# Altium project PoE_Injector_DownloadStation.PrjPcb (part 1 of 2)
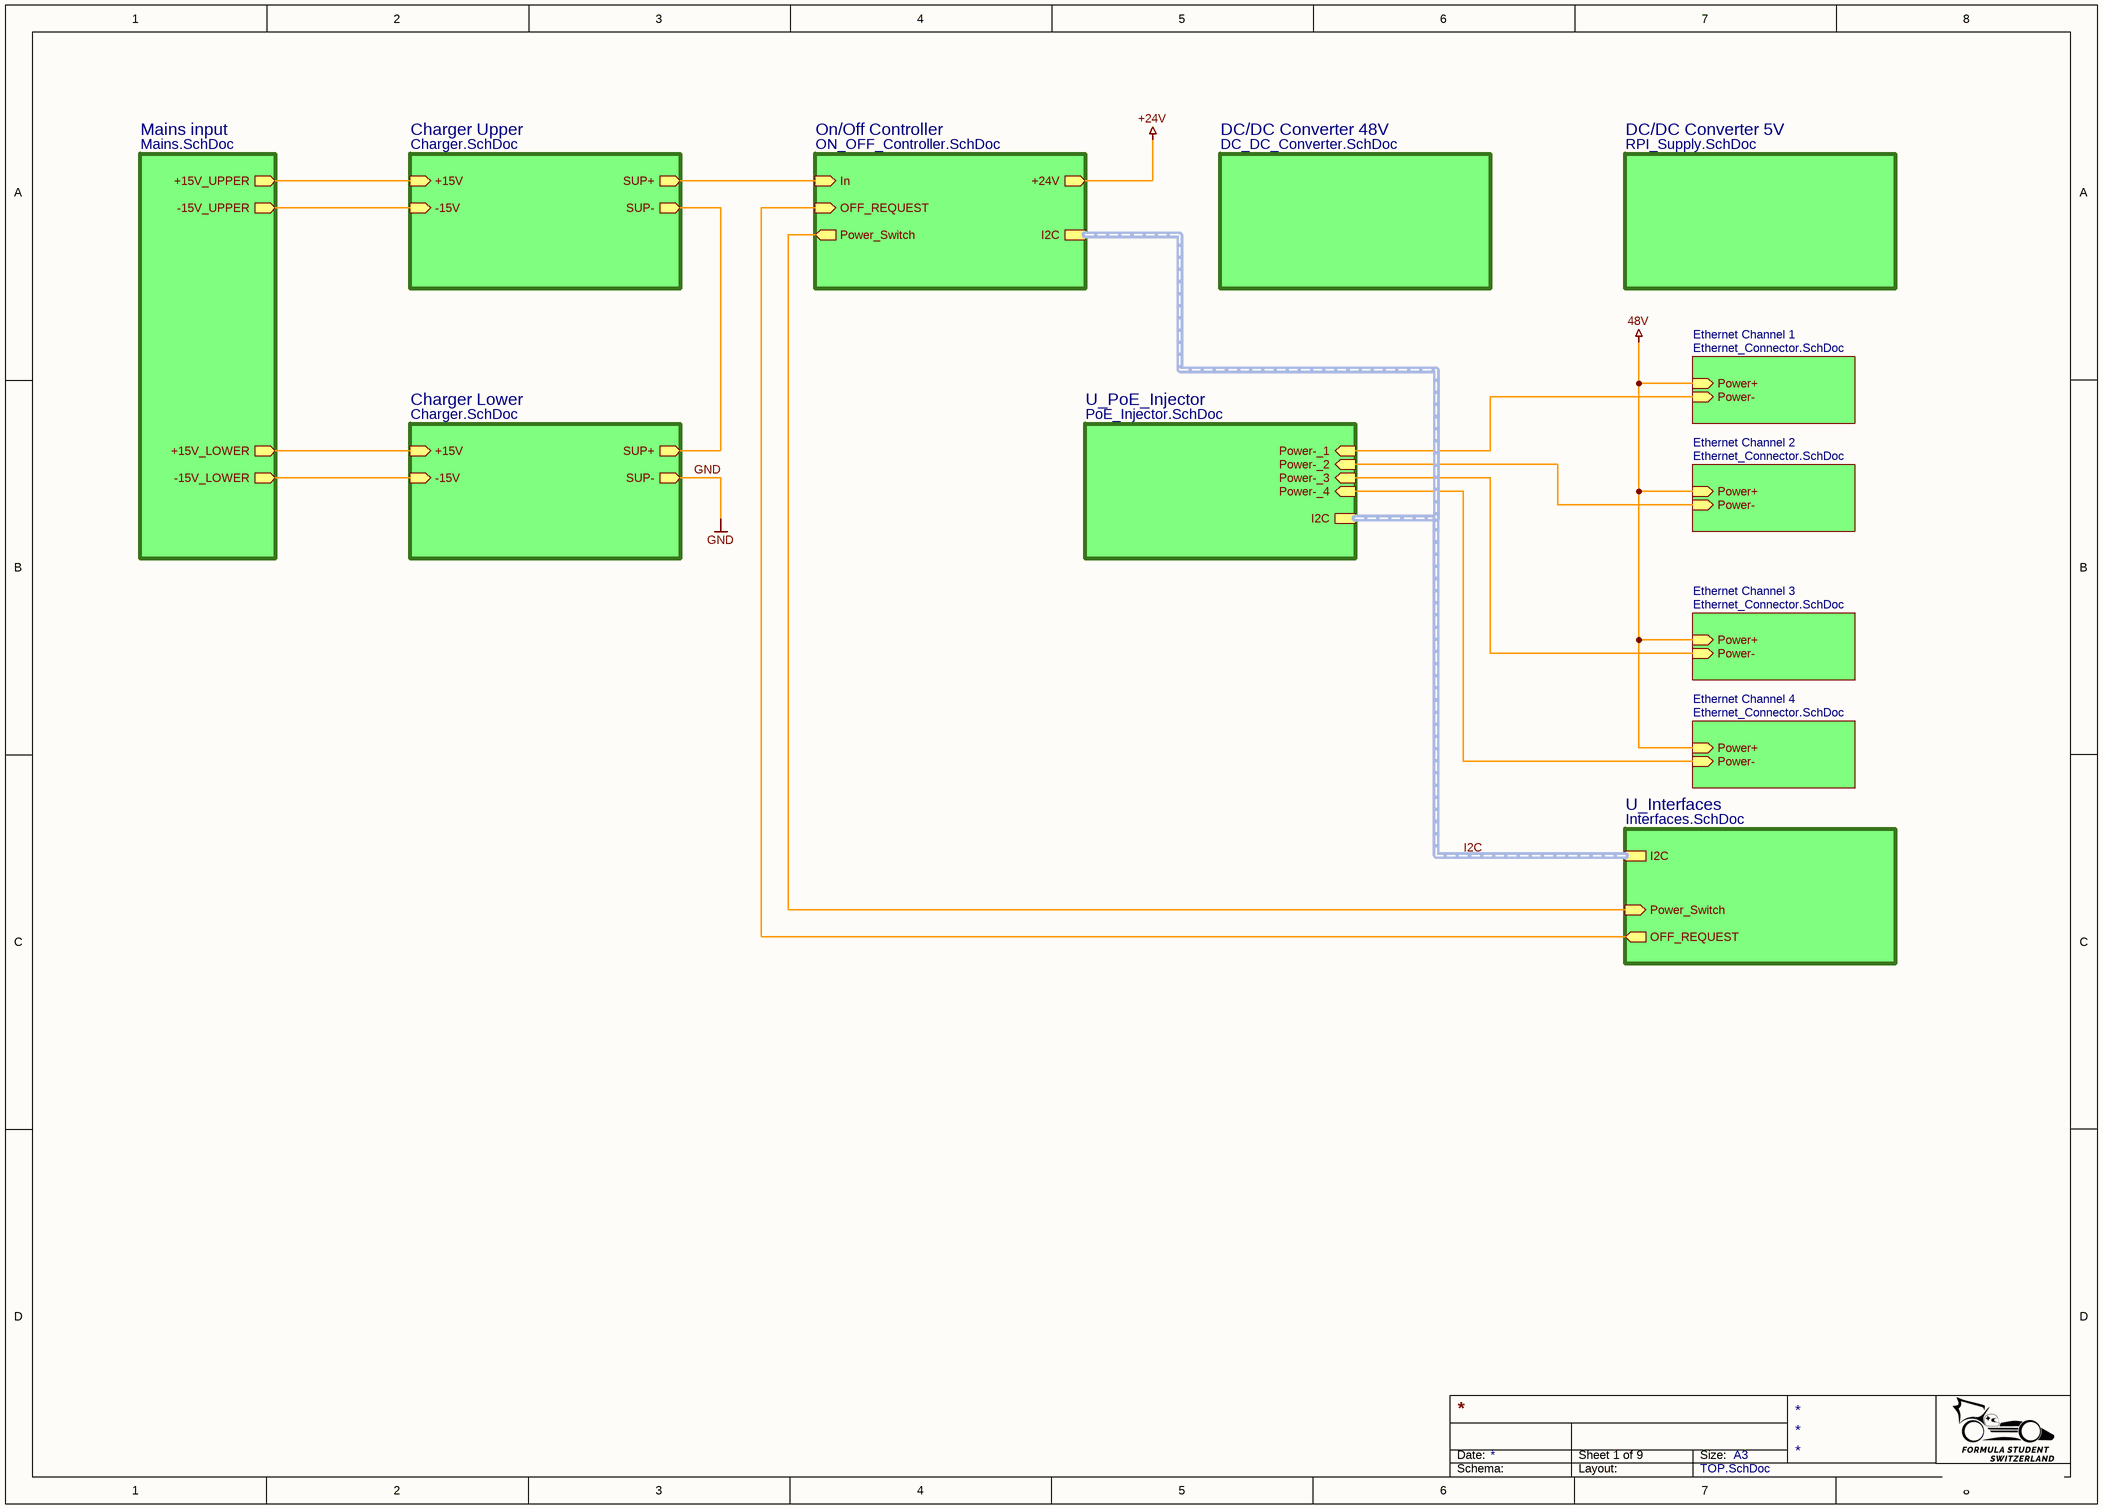
[diagram p0: TOP.SchDoc]
9 sheets, 375 parts. Net scope: hierarchical (ports join the sheet entries above them; power ports are global).
Sheets:
  TOP.SchDoc
    Charger Upper = Charger.SchDoc
    Charger Lower = Charger.SchDoc
    DC/DC Converter 48V = DC_DC_Converter.SchDoc
    U_PoE_Injector = PoE_Injector.SchDoc
    Mains input = Mains.SchDoc
    Ethernet Channel 1 = Ethernet_Connector.SchDoc
    Ethernet Channel 2 = Ethernet_Connector.SchDoc
    Ethernet Channel 3 = Ethernet_Connector.SchDoc
    Ethernet Channel 4 = Ethernet_Connector.SchDoc
    U_Interfaces = Interfaces.SchDoc
    DC/DC Converter 5V = RPI_Supply.SchDoc
    On/Off Controller = ON_OFF_Controller.SchDoc

## Sheet TOP.SchDoc
size A3; SheetNumber: 1; SheetTotal: 9

### Sub-sheets
Charger Lower = Charger.SchDoc: +15V (in), -15V (in), SUP+ (out), SUP- (out)
Charger Upper = Charger.SchDoc: +15V (in), -15V (in), SUP+ (out), SUP- (out)
DC/DC Converter 5V = RPI_Supply.SchDoc: no entries
DC/DC Converter 48V = DC_DC_Converter.SchDoc: no entries
Ethernet Channel 1 = Ethernet_Connector.SchDoc: Power+ (in), Power- (in)
Ethernet Channel 2 = Ethernet_Connector.SchDoc: Power+ (in), Power- (in)
Ethernet Channel 3 = Ethernet_Connector.SchDoc: Power+ (in), Power- (in)
Ethernet Channel 4 = Ethernet_Connector.SchDoc: Power+ (in), Power- (in)
Mains input = Mains.SchDoc: +15V_UPPER (out), -15V_UPPER (out), +15V_LOWER (out), -15V_LOWER (out)
On/Off Controller = ON_OFF_Controller.SchDoc: In (in), +24V (out), OFF_REQUEST (in), I2C (harness I2C), Power_Switch (out)
U_Interfaces = Interfaces.SchDoc: I2C (harness I2C), OFF_REQUEST (out), Power_Switch (in)
U_PoE_Injector = PoE_Injector.SchDoc: Power-_1 (in), Power-_2 (in), Power-_3 (in), Power-_4 (in), I2C (harness I2C)

### Nets
48V: sheet Ethernet Channel 1/Power+, sheet Ethernet Channel 2/Power+, sheet Ethernet Channel 3/Power+, sheet Ethernet Channel 4/Power+
GND: sheet Charger Lower/-15V, sheet Charger Lower/SUP-, sheet Mains input/-15V_LOWER
GND_BAT: sheet Charger Upper/-15V, sheet Charger Upper/SUP-, sheet Charger Lower/SUP+, sheet Mains input/-15V_UPPER
NetC200_Charger_Upper_1: sheet Charger Upper/SUP+, sheet On/Off Controller/In
NetC402_2: sheet U_PoE_Injector/Power-_1, sheet Ethernet Channel 1/Power-
NetC403_2: sheet U_PoE_Injector/Power-_2, sheet Ethernet Channel 2/Power-
NetC405_2: sheet U_PoE_Injector/Power-_3, sheet Ethernet Channel 3/Power-
NetC406_2: sheet U_PoE_Injector/Power-_4, sheet Ethernet Channel 4/Power-
NetC604_1: sheet U_Interfaces/OFF_REQUEST, sheet On/Off Controller/OFF_REQUEST
NetD800_2: sheet U_Interfaces/Power_Switch, sheet On/Off Controller/Power_Switch
NetQ200_Charger_Lower_D: sheet Charger Lower/+15V, sheet Mains input/+15V_LOWER
NetQ200_Charger_Upper_D: sheet Charger Upper/+15V, sheet Mains input/+15V_UPPER

### Buses and harness runs
harness I2C = sheet On/Off Controller/I2C = sheet U_Interfaces/I2C = sheet U_PoE_Injector/I2C

### Notes on the sheet
- Date:
- Size:
- A3
- Schema:
- Layout:

## Sheet Charger.SchDoc
size A2; SheetNumber: 3; SheetTotal: 9
Used 2 times, as channels Charger Upper, Charger Lower. Parts and nets are listed once, with the designators drawn on the sheet.
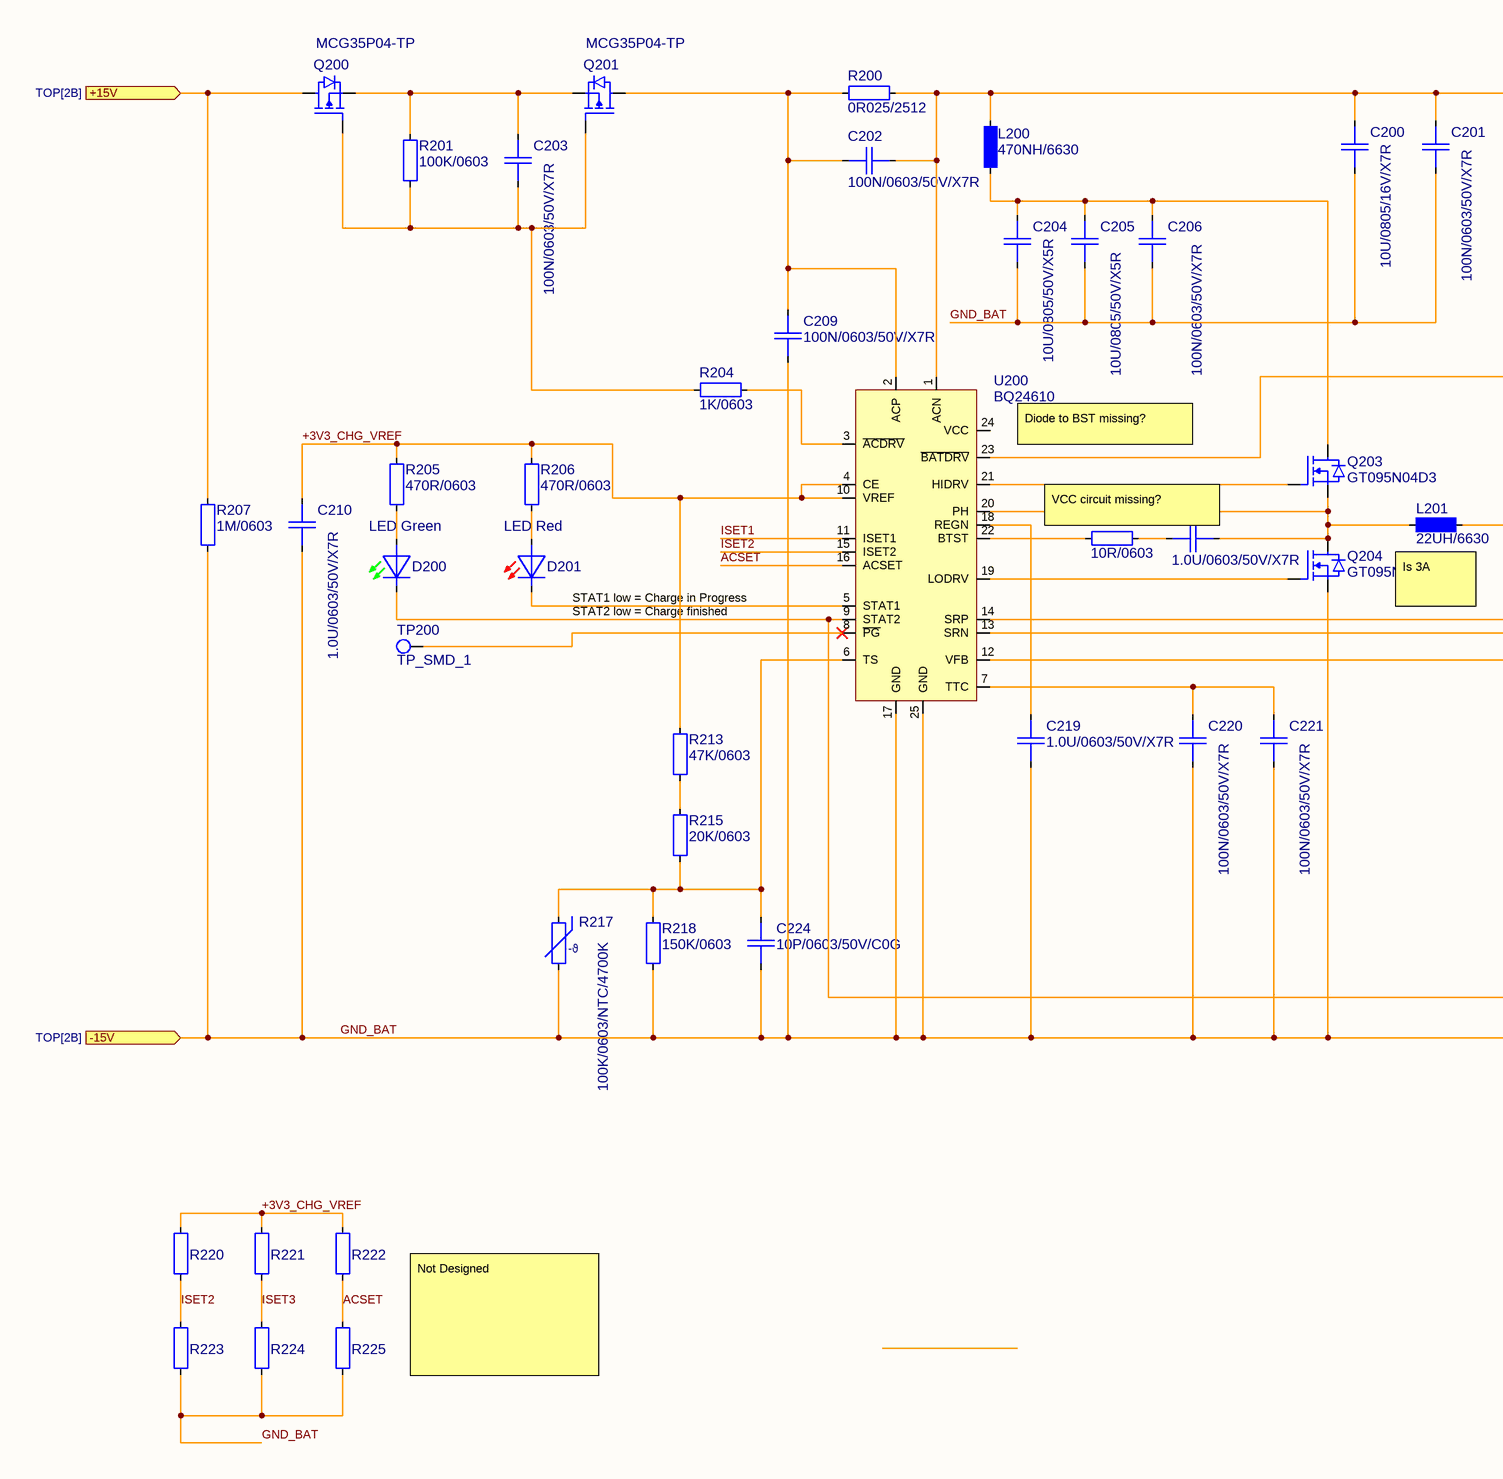
[diagram p1: Charger.SchDoc, left]
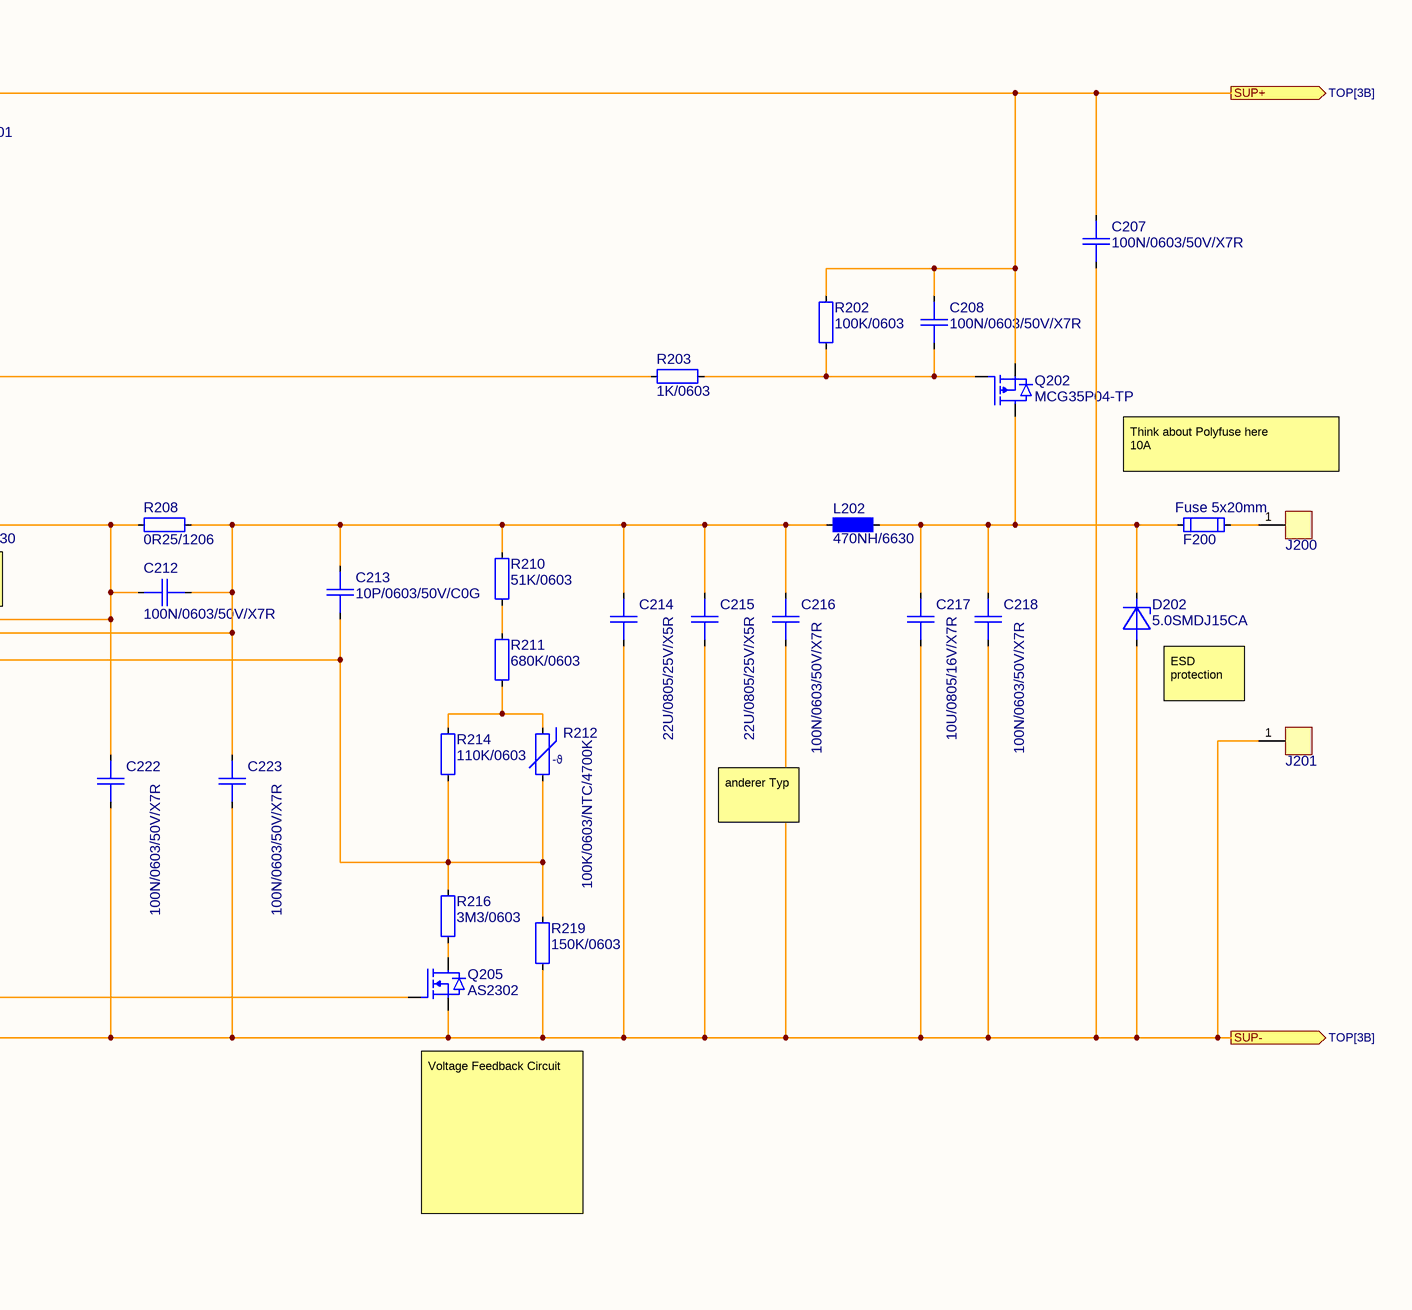
[diagram p2: Charger.SchDoc, right]

### Parts
C200  10U/0805/16V/X7R  [CAP0805_X7R]
C201  100N/0603/50V/X7R  [CAP0603_X7R]
C202  100N/0603/50V/X7R  [CAP0603_X7R]
C203  100N/0603/50V/X7R  [CAP0603_X7R]
C204  10U/0805/50V/X5R  [CAP0805_X7R]
C205  10U/0805/50V/X5R  [CAP0805_X7R]
C206  100N/0603/50V/X7R  [CAP0603_X7R]
C207  100N/0603/50V/X7R  [CAP0603_X7R]
C208  100N/0603/50V/X7R  [CAP0603_X7R]
C209  100N/0603/50V/X7R  [CAP0603_X7R]
C210  1.0U/0603/50V/X7R  [CAP0603_X7R]
C211  1.0U/0603/50V/X7R  [CAP0603_X7R]
C212  100N/0603/50V/X7R  [CAP0603_X7R]
C213  10P/0603/50V/C0G  [CAP0603_C0G]
C214  22U/0805/25V/X5R  [CAP0805_X7R]
C215  22U/0805/25V/X5R  [CAP0805_X7R]
C216  100N/0603/50V/X7R  [CAP0603_X7R]
C217  10U/0805/16V/X7R  [CAP0805_X7R]
C218  100N/0603/50V/X7R  [CAP0603_X7R]
C219  1.0U/0603/50V/X7R  [CAP0603_X7R]
C220  100N/0603/50V/X7R  [CAP0603_X7R]
C221  100N/0603/50V/X7R  [CAP0603_X7R]
C222  100N/0603/50V/X7R  [CAP0603_X7R]
C223  100N/0603/50V/X7R  [CAP0603_X7R]
C224  10P/0603/50V/C0G  [CAP0603_C0G]
D200  LED Green  [LED0603_GREEN]
D201  LED Red  [LED0603_RED]
D202  5.0SMDJ15CA  [DIOM7959X265]
F200  Fuse 5x20mm  [OGN_THR]
J200  6.35mmx0.81mm Tab THT  [Tab_THT_635]  (value not drawn)
J201  6.35mmx0.81mm Tab THT  [Tab_THT_635]  (value not drawn)
L200  470NH/6630  [INDM660730X30]
L201  22UH/6630  [INDM660730X30]
L202  470NH/6630  [INDM660730X30]
Q200  MCG35P04-TP  [SON065P330X330X075-5-TH245X175]
Q201  MCG35P04-TP  [SON065P330X330X075-5-TH245X175]
Q202  MCG35P04-TP  [SON065P330X330X075-5-TH245X175]
Q203  GT095N04D3  [SON065P330X330X075-5-TH245X175]
Q204  GT095N04D3  [SON065P330X330X075-5-TH245X175]
Q205  AS2302  [SOT2395P280X125-3-SE]
R200  0R025/2512  [R2512-0.65-WW]
R201  100K/0603  [R0603-0.40-WW]
R202  100K/0603  [R0603-0.40-WW]
R203  1K/0603  [R0603-0.40-WW]
R204  1K/0603  [R0603-0.40-WW]
R205  470R/0603  [R0603-0.40-WW]
R206  470R/0603  [R0603-0.40-WW]
R207  1M/0603  [R0603-0.40-WW]
R208  0R25/1206  [R1206-0.80-WW]
R209  10R/0603  [R0603-0.40-WW]
R210  51K/0603  [R0603-0.40-WW]
R211  680K/0603  [R0603-0.40-WW]
R212  100K/0603/NTC/4700K  [R0603-0.40-WW]
R213  47K/0603  [R0603-0.40-WW]
R214  110K/0603  [R0603-0.40-WW]
R215  20K/0603  [R0603-0.40-WW]
R216  3M3/0603  [R0603-0.40-WW]
R217  100K/0603/NTC/4700K  [R0603-0.40-WW]
R218  150K/0603  [R0603-0.40-WW]
R219  150K/0603  [R0603-0.40-WW]
R220  10K/0603  [R0603-0.40-WW]  (value not drawn)
R221  10K/0603  [R0603-0.40-WW]  (value not drawn)
R222  10K/0603  [R0603-0.40-WW]  (value not drawn)
R223  10K/0603  [R0603-0.40-WW]  (value not drawn)
R224  10K/0603  [R0603-0.40-WW]  (value not drawn)
R225  10K/0603  [R0603-0.40-WW]  (value not drawn)
TP200  TP_SMD_1  [TP_SMD_1]  (no BOM)
U200  BQ24610  [QFN050P400X400X100-24-TH245X245]

### Ports
+15V (in, see TOP[2B]), -15V (in, see TOP[2B]), SUP+ (out, see TOP[3B]), SUP- (out, see TOP[3B])

### Nets
+3V3_CHG_VREF: C210.1 R205.1 R206.1 R213.1 R220.1 R221.1 R222.1 U200.4(CE) U200.10(VREF)
+15V: Q200.D(DRAIN) R207.1 ; port +15V
ACSET: R222.2 R225.1 U200.16(ACSET)
GND_BAT: C200.2 C201.2 C204.2 C205.2 C206.2 C207.2 C209.2 C210.2 C214.2 C215.2 C216.2 C217.2 C218.2 C219.1 C220.2 C221.2 C222.2 C223.2 C224.2 D202.2 J201.1 Q204.S(SOURCE) Q205.2(SOURCE) R207.2 R217.2 R218.2 R219.2 R223.2 R224.2 R225.2 U200.17(GND) U200.25(GND) ; port -15V, port SUP-
ISET1: U200.11(ISET1)
ISET2: R220.2 R223.1 U200.15(ISET2)
ISET3: R221.2 R224.1
SUP+: C200.1 C201.1 C202.2 C207.1 C208.1 L200.1 Q202.S(SOURCE) R200.2 R202.1 U200.1(ACN) ; port SUP+
NetC202_1: C202.1 C209.1 Q201.D(DRAIN) R200.1 U200.2(ACP)
NetC203_1: C203.1 Q200.S(SOURCE) Q201.S(SOURCE) R201.1
NetC203_2: C203.2 Q200.G(GATE) Q201.G(GATE) R201.2 R204.1
NetC204_1: C204.1 C205.1 C206.1 L200.2 Q203.D(DRAIN)
NetC208_2: C208.2 Q202.G(GATE) R202.2 R203.2
NetC211_1: C211.1 R209.2
NetC211_2: C211.2 L201.1 Q203.S(SOURCE) Q204.D(DRAIN) U200.20(PH)
NetC212_1: C212.1 C222.1 L201.2 R208.1 U200.14(SRP)
NetC212_2: C212.2 C213.1 C214.1 C215.1 C216.1 C223.1 L202.2 R208.2 R210.1 U200.13(SRN)
NetC213_2: C213.2 R212.2 R214.2 R216.1 R219.1 U200.12(VFB)
NetC217_1: C217.1 C218.1 D202.1 F200.1 L202.1 Q202.D(DRAIN)
NetC219_2: C219.2 U200.18(REGN)
NetC220_1: C220.1 C221.1 U200.7(TTC)
NetC224_1: C224.1 R215.2 R217.1 R218.1 U200.6(TS)
NetD200_1: D200.1 Q205.1(GATE) U200.9(STAT2)
NetD200_2: D200.2 R205.2
NetD201_1: D201.1 U200.5(STAT1)
NetD201_2: D201.2 R206.2
NetF200_2: F200.2 J200.1
NetQ203_G: Q203.G(GATE) U200.21(HIDRV)
NetQ204_G: Q204.G(GATE) U200.19(LODRV)
NetQ205_3: Q205.3(DRAIN) R216.2
NetR203_1: R203.1 U200.23(~{BATDRV})
NetR204_2: R204.2 U200.3(~{ACDRV})
NetR209_1: R209.1 U200.22(BTST)
NetR210_2: R210.2 R211.1
NetR211_2: R211.2 R212.1 R214.1
NetR213_2: R213.2 R215.1
NetTP200_1: TP200.1 U200.8(~{PG})

Not connected (* = marked no-connect by the designer): U200 24(VCC)

### Channels
Charger Upper: designators end in _Charger_Upper; ports +15V=NetQ200_Charger_Upper_D -15V=GND_BAT SUP+=NetC200_Charger_Upper_1 SUP-=GND_BAT
Charger Lower: designators end in _Charger_Lower; ports +15V=NetQ200_Charger_Lower_D -15V=GND SUP+=GND_BAT SUP-=GND

### Notes on the sheet
- (near U200) Diode to BST missing?
- VCC circuit missing?
- Think about Polyfuse here
  10A
- (near D201) STAT1 low = Charge in Progress
- (near D201) STAT2 low = Charge finished
- (near L201) Is 3A
- (near D202) ESD protection
- anderer Typ
- Voltage Feedback Circuit
- Not Designed
- Date:
- Schema:
- Layout:
- Size:
- A3
- (in symbol 100K/0603/NTC/4700K) -ϑ

### Library data of the parts
C200 C217 = 10U/0805/16V/X7R: CAP SM 0805 10uF 16V X7R; Manufacturer: GENERIC; Manufacturer 1: Cal-Chip Electronics, Inc.; Manufacturer Part Number 1: GMC21X7R106K16NT; Absolute Value: 1E-5; Eurocircuits GPN: GPN0805106-16; Part Number: 10U/0805/16V/X7R; Package: 0805; Value: 10uF; HelpURL: https://88ce57.p3cdn1.secureserver.net/wp-content/uploads/2023/01/gmc_series-2.pdf; Supplier 1: Digi-Key; Supplier Part Number 1: 4713-GMC21X7R106K16NTCT-ND; Manufacturer 2: Samsung Electro-Mechanics; Manufacturer Part Number 2: CL21B106KOQNNNE; Supplier 2: Digi-Key; Supplier Part Number 2: 1276-2872-1-ND; Supplier 3: LCSC; Supplier Part Number 3: C95841; JLC Type: Basic
C201-C203 C206-C209 C212 C216 C218 C220-C223 = 100N/0603/50V/X7R: CAP SM 0603 100nF 50V X7R; Manufacturer: GENERIC; Manufacturer 1: YAGEO; Manufacturer Part Number 1: CC0603KPX7R9BB104; Absolute Value: 1E-7; Eurocircuits GPN: GPC0603104; Part Number: 100N/0603/50V/X7R; Package: 0603; Value: 100nF; HelpURL: https://www.yageo.com/upload/media/product/app/datasheet/mlcc/upy-gphc_x7r_6_3v-to-250v.pdf; Supplier 1: Digi-Key; Supplier Part Number 1: 311-3567-1-ND; Manufacturer 2: YAGEO; Manufacturer Part Number 2: CC0603MRX7R9BB104; Supplier 2: Digi-Key; Supplier Part Number 2: 311-4110-1-ND; Supplier 3: LCSC; Supplier Part Number 3: C14663; JLC Type: Basic
C204 C205 = 10U/0805/50V/X5R: CAP SM 0805 10uF 50V X5R; Manufacturer: GENERIC; Manufacturer 1: Murata Electronics; Manufacturer Part Number 1: GRM21BR61H106KE43K; Absolute Value: 1E-5; Eurocircuits GPN: GPN0805106-50-X5R; Part Number: 10U/0805/50V/X5R; Package: 0805; Value: 10uF; HelpURL: https://search.murata.co.jp/Ceramy/image/img/A01X/G101/ENG/GRM21BR61H106KE43-01A.pdf; Supplier 1: Digi-Key; Supplier Part Number 1: 490-GRM21BR61H106KE43KCT-ND; Manufacturer Part Number 3: GRM21BR61H106KE43L; Supplier 3: LCSC; Supplier Part Number 3: C440198; JLC Type: Basic
C210 C211 C219 = 1.0U/0603/50V/X7R: CAP SM 0603 1.0uF 50V X7R; Manufacturer: GENERIC; Manufacturer 1: YAGEO; Manufacturer Part Number 1: CC0603KRX7R9BB105; Absolute Value: 1E-6; Eurocircuits GPN: GPC0603105; Part Number: 1.0U/0603/50V/X7R; Package: 0603; Value: 1.0uF; HelpURL: https://www.yageo.com/upload/media/product/app/datasheet/mlcc/upy-gphc_x7r_6_3v-to-250v.pdf; Supplier 1: Digi-Key; Supplier Part Number 1: 311-2082-1-ND
C213 C224 = 10P/0603/50V/C0G: CAP SM 0603 10pF 50V C0G; Manufacturer: GENERIC; Manufacturer 1: YAGEO; Manufacturer Part Number 1: CC0603JRNPO9BN100; Absolute Value: 1E-11; Eurocircuits GPN: GPC0603100-C0G; Part Number: 10P/0603/50V/C0G; Package: 0603; Value: 10pF; HelpURL: https://www.yageo.com/upload/media/product/productsearch/datasheet/mlcc/UPY-GP_NP0_16V-to-50V_18.pdf; Supplier 1: Digi-Key; Supplier Part Number 1: 311-1058-1-ND; Manufacturer 2: YAGEO; Manufacturer Part Number 2: CC0603KRNPO9BN100; Supplier 2: Digi-Key; Supplier Part Number 2: 311-4025-1-ND
C214 C215 = 22U/0805/25V/X5R: CAP SM 0805 22uF 25V X5R; Manufacturer: GENERIC; Manufacturer 1: Samsung Electro-Mechanics; Manufacturer Part Number 1: CL21A226MAYNNNE; Absolute Value: 2.2E-5; Eurocircuits GPN: GPN0805106-25; Part Number: 22U/0805/25V/X5R; Package: 0805; Value: 22uF; HelpURL: https://mm.digikey.com/Volume0/opasdata/d220001/medias/docus/339/CL21A226MAYNNNE_Spec.pdf; Supplier 1: Digi-Key; Supplier Part Number 1: 1276-CL21A226MAYNNNECT-ND; Manufacturer Part Number 3: CL21A226MAQNNNE; Supplier 3: LCSC; Supplier Part Number 3: C45783; JLC Type: Basic
D200 = LED Green 0603: Generic LED Green 0603; Manufacturer 1: Würth; Manufacturer Part Number 1: 150060VS75000; Part Number: LED Green 0603; Manufacturer: GENERIC; Package: 603; Value: Green; Absolute Value: Green; HelpURL: https://www.we-online.com/katalog/datasheet/150060VS75000.pdf; Supplier 1: Digi-Key; Supplier Part Number 1: 732-4980-1-ND; Manufacturer 3: Everlight Elec; Manufacturer Part Number 3: 19-217/GHC-YR1S2/3T; Supplier 3: LCSC; Supplier Part Number 3: C72043; JLC Type: Basic
D201 = LED Red 0603: Generic LED Red 0603; Manufacturer 1: Würth; Manufacturer Part Number 1: 150060RS75000; Part Number: LED Red 0603; Manufacturer: GENERIC; Package: 603; Value: Red; Absolute Value: Red; HelpURL: https://www.we-online.com/katalog/datasheet/150060RS75000.pdf; Supplier 1: Digi-Key; Supplier Part Number 1: 732-4978-1-ND; Manufacturer 3: Hubei KENTO Elec; Manufacturer Part Number 3: KT-0603R; Supplier 3: LCSC; Supplier Part Number 3: C2286; JLC Type: Basic
D202 = 5.0SMDJ15CA: TVS DIODE 15VWM 24.4V DO214 TR13; Manufacturer: Littelfuse Inc.; Manufacturer Part Number 1: 5.0SMDJ15CAS; Absolute Value: 15V; Part Number: 5.0SMDJ15CA; Package: DO-214AB, SMC; Value: 5.0SMDJ15CA; HelpURL: https://m.littelfuse.com/~/media/electronics/datasheets/tvs_diodes/littelfuse_tvs_diode_5_0smdjxxs_datasheet.pdf.pdf; Manufacturer 1: Littelfuse Inc.; Supplier 1: Digi-Key; Supplier Part Number 1: 18-5.0SMDJ15CASCT-ND; Manufacturer 2: Littelfuse Inc.; Manufacturer Part Number 2: 5.0SMDJ15CA; Supplier 2: Digi-Key; Supplier Part Number 2: 5.0SMDJ15CACT-ND
F200 = Fuse/5x20mm/OGN: open fuse holder, 5 x 20 mm, THR, IEC 60335-1; Manufacturer: Schurter; Manufacturer Part Number 1: 3-132-873; Part Number: Fuse/5x20mm/OGN; Package: 5X20; HelpURL: https://www.schurter.com/en/datasheet/typ_OGN.pdf; Manufacturer 1: Schurter; Supplier 1: Digi-Key; Supplier Part Number 1: 486-3-132-873-ND
J200 J201 = Tab_025_THT: CONN QC TAB 0.250 SOLDER; Manufacturer: GENERIC; Manufacturer 1: TE Connectivity AMP Connectors; Manufacturer Part Number 1: 1217861-1; Part Number: Tab_025_THT; HelpURL: https://www.te.com/usa-en/product-1217861-1.datasheet.pdf; Supplier 1: Digi-Key; Supplier Part Number 1: A100452CT-ND; Manufacturer 3: TE Connectivity; Manufacturer Part Number 3: 1217861-1; Supplier 3: LCSC; Supplier Part Number 3: C428480
L200 L202 = 470NH/6630: FIXED IND 470NH 16.5 A 5.5 MOHM SMD; Manufacturer: GENERIC; Manufacturer 1: Pulse Electronics; Manufacturer Part Number 1: BMRA00060630R47MA1; Absolute Value: 4.7E-7; Part Number: 470NH/6630; Package: 6030 Inductor; Value: 470NH; HelpURL: https://productfinder.pulseelectronics.com/api/open/part-attachments/datasheet/BMRA00060630R47MA1; Supplier 1: Digi-Key; Supplier Part Number 1: 553-BMRA00060630R47MA1CT-ND
L201 = 22UH/6630: FIXED IND 22UH     3 A 145 MOHM SMD; Manufacturer: GENERIC; Manufacturer 1: Pulse Electronics; Manufacturer Part Number 1: BMRA00060630220MA1; Absolute Value: 2.2E-5; Part Number: 22UH/6630; Package: 6030 Inductor; Value: 22UH; HelpURL: https://productfinder.pulseelectronics.com/api/open/part-attachments/datasheet/BMRA00060630220MA1; Supplier 1: Digi-Key; Supplier Part Number 1: 553-BMRA00060630220MA1CT-ND
Q200-Q202 = MCG35P04-TP: 40V 35A P-Channel MOSFET; Manufacturer: Micro Commercial Co; Manufacturer Part Number 1: 353-MCG35P04-TPCT-ND; Part Number: MCG35P04-TP; HelpURL: https://www.mccsemi.com/pdf/Products/MCG35P04(DFN3333).pdf; Manufacturer 1: Micro Commercial Co; Supplier 1: Digi-Key; Supplier Part Number 1: 353-MCG35P04-TPCT-ND
Q203 Q204 = GT095N04D3: 40V 47A N-Channel MOSFET; Manufacturer: Goford Semiconductor; Part Number: GT095N04D3; HelpURL: http://www.gofordsemi.com/u_file/product/834/GOFORD-GT095N04D3.pdf; Manufacturer 1: Goford Semiconductor; Manufacturer Part Number 1: GT095N04D3; Supplier 1: Digi-Key; Supplier Part Number 1: 3141-GT095N04D3CT-ND
Q205 = AS2302: N-Channel 20V(D-S) MOSFET; Manufacturer: GENERIC; Manufacturer 1: ANBON SEMICONDUCTOR (INT'L) LIMITED; Part Number: AS2302; Package: SOT23; HelpURL: https://datasheet.lcsc.com/lcsc/1809211431_AnBon-AS2302_C232266.pdf; Manufacturer Part Number 1: AS2302; Supplier 1: Digi-Key; Supplier Part Number 1: 4530-AS2302CT-ND; Manufacturer 3: AnBon; Manufacturer Part Number 3: AS2302; Supplier 3: LCSC; Supplier Part Number 3: C232266; JLC Type: Extended
R200 = 0R025/2512: RES SM 2512 0R025; Manufacturer: GENERIC; Manufacturer 1: Ohmite; Manufacturer Part Number 1: MCS3264R025FER; Absolute Value: 0.025; Part Number: 0R025/2512; Package: 2512; Value: 0R025; HelpURL: https://www.ohmite.com/assets/docs/res_mcs.pdf?r=false; Supplier 1: Digi-Key; Supplier Part Number 1: MCS3264R025FERCT-ND
R201 R202 = 100K/0603: RES SM 0603 100K; Manufacturer: GENERIC; Manufacturer 1: YAGEO; Manufacturer Part Number 1: RC0603FR-13100KL; Absolute Value: 100000; Eurocircuits GPN: GPR0603100K; Part Number: 100K/0603; Package: 0603; Value: 100K; HelpURL: https://www.yageo.com/upload/media/product/productsearch/datasheet/rchip/PYu-RC_Group_51_RoHS_L_12.pdf; Supplier 1: Digi-Key; Supplier Part Number 1: 13-RC0603FR-13100KLCT-ND; Manufacturer 2: YAGEO; Manufacturer Part Number 2: RC0603FR-10100KL; Supplier 2: Digi-Key; Supplier Part Number 2: 13-RC0603FR-10100KLCT-ND; Manufacturer 3: UNI-ROYAL(Uniroyal Elec); Manufacturer Part Number 3: 0603WAF1003T5E; Supplier 3: LCSC; Supplier Part Number 3: C25803; JLC Type: Basic
R203 R204 = 1K/0603: RES SM 0603 1K; Manufacturer: GENERIC; Manufacturer 1: YAGEO; Manufacturer Part Number 1: RC0603FR-131KL; Absolute Value: 1000; Eurocircuits GPN: GPR06031K; Part Number: 1K/0603; Package: 0603; Value: 1K; HelpURL: https://www.yageo.com/upload/media/product/app/datasheet/rchip/pyu-rc_group_51_rohs_l.pdf; Supplier 1: Digi-Key; Supplier Part Number 1: 13-RC0603FR-131KLCT-ND; Manufacturer 2: YAGEO; Manufacturer Part Number 2: RC0603FR-101KL; Supplier 2: Digi-Key; Supplier Part Number 2: 13-RC0603FR-101KLCT-ND; Manufacturer 3: UNI-ROYAL(Uniroyal Elec); Manufacturer Part Number 3: 0603WAF1001T5E; Supplier 3: LCSC; Supplier Part Number 3: C21190; JLC Type: Basic
R205 R206 = 470R/0603: RES SM 0603 470R; Manufacturer: GENERIC; Manufacturer 1: YAGEO; Manufacturer Part Number 1: RC0603FR-13470RL; Absolute Value: 470; Eurocircuits GPN: GPR0603470R; Part Number: 470R/0603; Package: 0603; Value: 470R; HelpURL: https://www.yageo.com/upload/media/product/app/datasheet/rchip/pyu-rc_group_51_rohs_l.pdf; Supplier 1: Digi-Key; Supplier Part Number 1: 13-RC0603FR-13470RLCT-ND; Manufacturer 2: YAGEO; Manufacturer Part Number 2: RC0603FR-10470RL; Supplier 2: Digi-Key; Supplier Part Number 2: 13-RC0603FR-10470RLCT-ND
R207 = 1M/0603: RES SM 0603 1M; Manufacturer: GENERIC; Manufacturer 1: YAGEO; Manufacturer Part Number 1: RC0603FR-131ML; Absolute Value: 1000000; Eurocircuits GPN: GPR06031M; Part Number: 1M/0603; Package: 0603; Value: 1M; HelpURL: https://www.yageo.com/upload/media/product/app/datasheet/rchip/pyu-rc_group_51_rohs_l.pdf; Supplier 1: Digi-Key; Supplier Part Number 1: 13-RC0603FR-131MLCT-ND; Manufacturer 2: YAGEO; Manufacturer Part Number 2: RC0603FR-101ML; Supplier 2: Digi-Key; Supplier Part Number 2: 13-RC0603FR-101MLCT-ND; Manufacturer 3: UNI-ROYAL(Uniroyal Elec); Manufacturer Part Number 3: 0603WAF1004T5E; Supplier 3: C22935; Supplier Part Number 3: LCSC; JLC Type: Basic
R208 = 0R25/1206: RES SM 1206 0R25; Manufacturer: GENERIC; Manufacturer 1: YAGEO; Manufacturer Part Number 1: RC1206FR-0715RL; Absolute Value: 0.25; Eurocircuits GPN: GPR12060R25; Part Number: 0R25/1206; Package: 1206; Value: 0R25; HelpURL: https://www.yageo.com/upload/media/product/app/datasheet/rchip/pyu-rl_group_521_rohs_l.pdf; Supplier 1: Digi-Key; Supplier Part Number 1: 311-.25LWCT-ND; Manufacturer 3: RALEC; Manufacturer Part Number 3: RLT06R25JTP; Supplier 3: LCSC; Supplier Part Number 3: C7500327
R209 = 10R/0603: RES SM 0603 10R; Manufacturer: GENERIC; Manufacturer 1: YAGEO; Manufacturer Part Number 1: RC0603FR-1310RL; Absolute Value: 10; Eurocircuits GPN: GPR060310R; Part Number: 10R/0603; Package: 0603; Value: 10R; HelpURL: https://www.yageo.com/upload/media/product/app/datasheet/rchip/pyu-rc_group_51_rohs_l.pdf; Supplier 1: Digi-Key; Supplier Part Number 1: 13-RC0603FR-1310RLCT-ND; Manufacturer 2: YAGEO; Manufacturer Part Number 2: RC0603FR-1010RL; Supplier 2: Digi-Key; Supplier Part Number 2: 13-RC0603FR-1010RLCT-ND
R210 = 51K/0603: RES SM 0603 51K; Manufacturer: GENERIC; Manufacturer 1: YAGEO; Manufacturer Part Number 1: RC0603FR-1351KL; Absolute Value: 51000; Eurocircuits GPN: GPR060351K; Part Number: 51K/0603; Package: 0603; Value: 51K; HelpURL: https://www.yageo.com/upload/media/product/app/datasheet/rchip/pyu-rc_group_51_rohs_l.pdf; Supplier 1: Digi-Key; Supplier Part Number 1: 13-RC0603FR-1351KLCT-ND; Manufacturer 2: YAGEO; Manufacturer Part Number 2: RC0603FR-1051KL; Supplier 2: Digi-Key; Supplier Part Number 2: 13-RC0603FR-1051KLCT-ND; Supplier 3: LCSC; Supplier Part Number 3: C2933234; JLC Type: Basic
R211 = 680K/0603: RES SM 0603 680K; Manufacturer: GENERIC; Manufacturer 1: YAGEO; Manufacturer Part Number 1: RC0603FR-13680KL; Absolute Value: 680000; Eurocircuits GPN: GPR0603680K; Part Number: 680K/0603; Package: 0603; Value: 680K; HelpURL: https://www.yageo.com/upload/media/product/app/datasheet/rchip/pyu-rc_group_51_rohs_l.pdf; Supplier 1: Digi-Key; Supplier Part Number 1: 13-RC0603FR-13680KLCT-ND; Manufacturer 2: YAGEO; Manufacturer Part Number 2: RC0603FR-07680KL; Supplier 2: Digi-Key; Supplier Part Number 2: 311-680KHRCT-ND
R212 R217 = 100K/0603/NTC/4700K: RES NTC SM 0603 100k 4700K; Manufacturer: GENERIC; Manufacturer 1: Panasonic Electronic Components; Manufacturer Part Number 1: ERT-J1VV104F; Absolute Value: 100000; Part Number: 100K/0603/NTC/4700K; Package: 0603; Value: 100K; HelpURL: https://industrial.panasonic.com/cdbs/www-data/pdf/AUA0000/AUA0000C8.pdf; Supplier 1: Digi-Key; Supplier Part Number 1: P124047CT-ND
R213 = 47K/0603: RES SM 0603 47K; Manufacturer: GENERIC; Manufacturer 1: YAGEO; Manufacturer Part Number 1: RC0603FR-1347KL; Absolute Value: 47000; Eurocircuits GPN: GPR060347K; Part Number: 47K/0603; Package: 0603; Value: 47K; HelpURL: https://www.yageo.com/upload/media/product/app/datasheet/rchip/pyu-rc_group_51_rohs_l.pdf; Supplier 1: Digi-Key; Supplier Part Number 1: 13-RC0603FR-1347KLCT-ND; Manufacturer 2: YAGEO; Manufacturer Part Number 2: RC0603FR-1047KL; Supplier 2: Digi-Key; Supplier Part Number 2: 13-RC0603FR-1047KLCT-ND; Manufacturer 3: UNI-ROYAL(Uniroyal Elec); Manufacturer Part Number 3: 0603WAF4702T5E; Supplier 3: LCSC; Supplier Part Number 3: C25819; JLC Type: Basic
R214 = 110K/0603: RES SM 0603 110K; Manufacturer: GENERIC; Manufacturer 1: YAGEO; Manufacturer Part Number 1: RC0603FR-13110KL; Absolute Value: 110000; Eurocircuits GPN: GPR0603110K; Part Number: 110K/0603; Package: 0603; Value: 110K; HelpURL: https://www.yageo.com/upload/media/product/productsearch/datasheet/rchip/PYu-RC_Group_51_RoHS_L_12.pdf; Supplier 1: Digi-Key; Supplier Part Number 1: 13-RC0603FR-13110KLCT-ND; Manufacturer 2: YAGEO; Manufacturer Part Number 2: RC0603FR-07110KL; Supplier 2: Digi-Key; Supplier Part Number 2: 311-110KHRCT-ND
R215 = 20K/0603: RES SM 0603 20K; Manufacturer: GENERIC; Manufacturer 1: YAGEO; Manufacturer Part Number 1: RC0603FR-1320KL; Absolute Value: 20000; Eurocircuits GPN: GPR060320K; Part Number: 20K/0603; Package: 0603; Value: 20K; HelpURL: https://www.yageo.com/upload/media/product/app/datasheet/rchip/pyu-rc_group_51_rohs_l.pdf; Supplier 1: Digi-Key; Supplier Part Number 1: 13-RC0603FR-1320KLCT-ND; Manufacturer 2: YAGEO; Manufacturer Part Number 2: RC0603FR-1020KL; Supplier 2: Digi-Key; Supplier Part Number 2: 13-RC0603FR-1020KLCT-ND
R216 = 3M3/0603: RES SM 0603 3M3; Manufacturer: GENERIC; Manufacturer 1: YAGEO; Manufacturer Part Number 1: RC0603FR-073M3L; Absolute Value: 3300000; Eurocircuits GPN: GPR06033M3; Part Number: 3M3/0603; Package: 0603; Value: 3M3; HelpURL: https://www.yageo.com/upload/media/product/app/datasheet/rchip/pyu-rc_group_51_rohs_l.pdf; Supplier 1: Digi-Key; Supplier Part Number 1: 13-RC0603FR-073M3LCT-ND
R218 R219 = 150K/0603: RES SM 0603 150K; Manufacturer: GENERIC; Manufacturer 1: YAGEO; Manufacturer Part Number 1: RC0603FR-13150KL; Absolute Value: 150000; Eurocircuits GPN: GPR0603150K; Part Number: 150K/0603; Package: 0603; Value: 150K; HelpURL: https://www.yageo.com/upload/media/product/app/datasheet/rchip/pyu-rc_group_51_rohs_l.pdf; Supplier 1: Digi-Key; Supplier Part Number 1: 13-RC0603FR-13150KLCT-ND; Manufacturer 2: YAGEO; Manufacturer Part Number 2: RC0603FR-10150KL; Supplier 2: Digi-Key; Supplier Part Number 2: 13-RC0603FR-10150KLCT-ND; Manufacturer 3: UNI-ROYAL(Uniroyal Elec); Manufacturer Part Number 3: 0603WAF1503T5E; Supplier 3: LCSC; Supplier Part Number 3: C22807; JLC Type: Basic
R220-R225 = 10K/0603: RES SM 0603 10K; Manufacturer: GENERIC; Manufacturer 1: YAGEO; Manufacturer Part Number 1: RC0603FR-1310KL; Absolute Value: 10000; Eurocircuits GPN: GPR060310K; Part Number: 10K/0603; Package: 0603; Value: 10K; HelpURL: https://www.yageo.com/upload/media/product/productsearch/datasheet/rchip/PYu-RC_Group_51_RoHS_L_12.pdf; Supplier 1: Digi-Key; Supplier Part Number 1: 13-RC0603FR-1310KLCT-ND; Manufacturer 2: YAGEO; Manufacturer Part Number 2: RC0603FR-1010KL; Supplier 2: Digi-Key; Supplier Part Number 2: 13-RC0603FR-1010KLCT-ND; Manufacturer 3: UNI-ROYAL(Uniroyal Elec); Manufacturer Part Number 3: 0603WAF1002T5E; Supplier 3: LCSC; Supplier Part Number 3: C25804; JLC Type: Basic
TP200 = TP_SMD_1: SMD Test Point 1mm; Manufacturer: NONE; Part Number: TP_SMD_1
U200 = BQ24610: BQ2461x Stand-Alone 1- to 6-Cell Synchronous Buck Battery Charger Controller; Manufacturer: Texas Instruments; Manufacturer Part Number 1: BQ24610RGER; Part Number: BQ24610; Package: QFN-24; HelpURL: https://www.ti.com/lit/ds/symlink/bq24610.pdf; Manufacturer 1: Texas Instruments; Supplier 1: Digi-Key; Supplier Part Number 1: 296-29437-1-ND; Manufacturer 3: Texas Instruments; Manufacturer Part Number 3: BQ24610RGER; Supplier 3: LCSC; Supplier Part Number 3: C19384

## Sheet DC_DC_Converter.SchDoc: Power Supply
size A3; Author: ahorat; CompanyName: FSCH; SheetNumber: 4; SheetTotal: 9
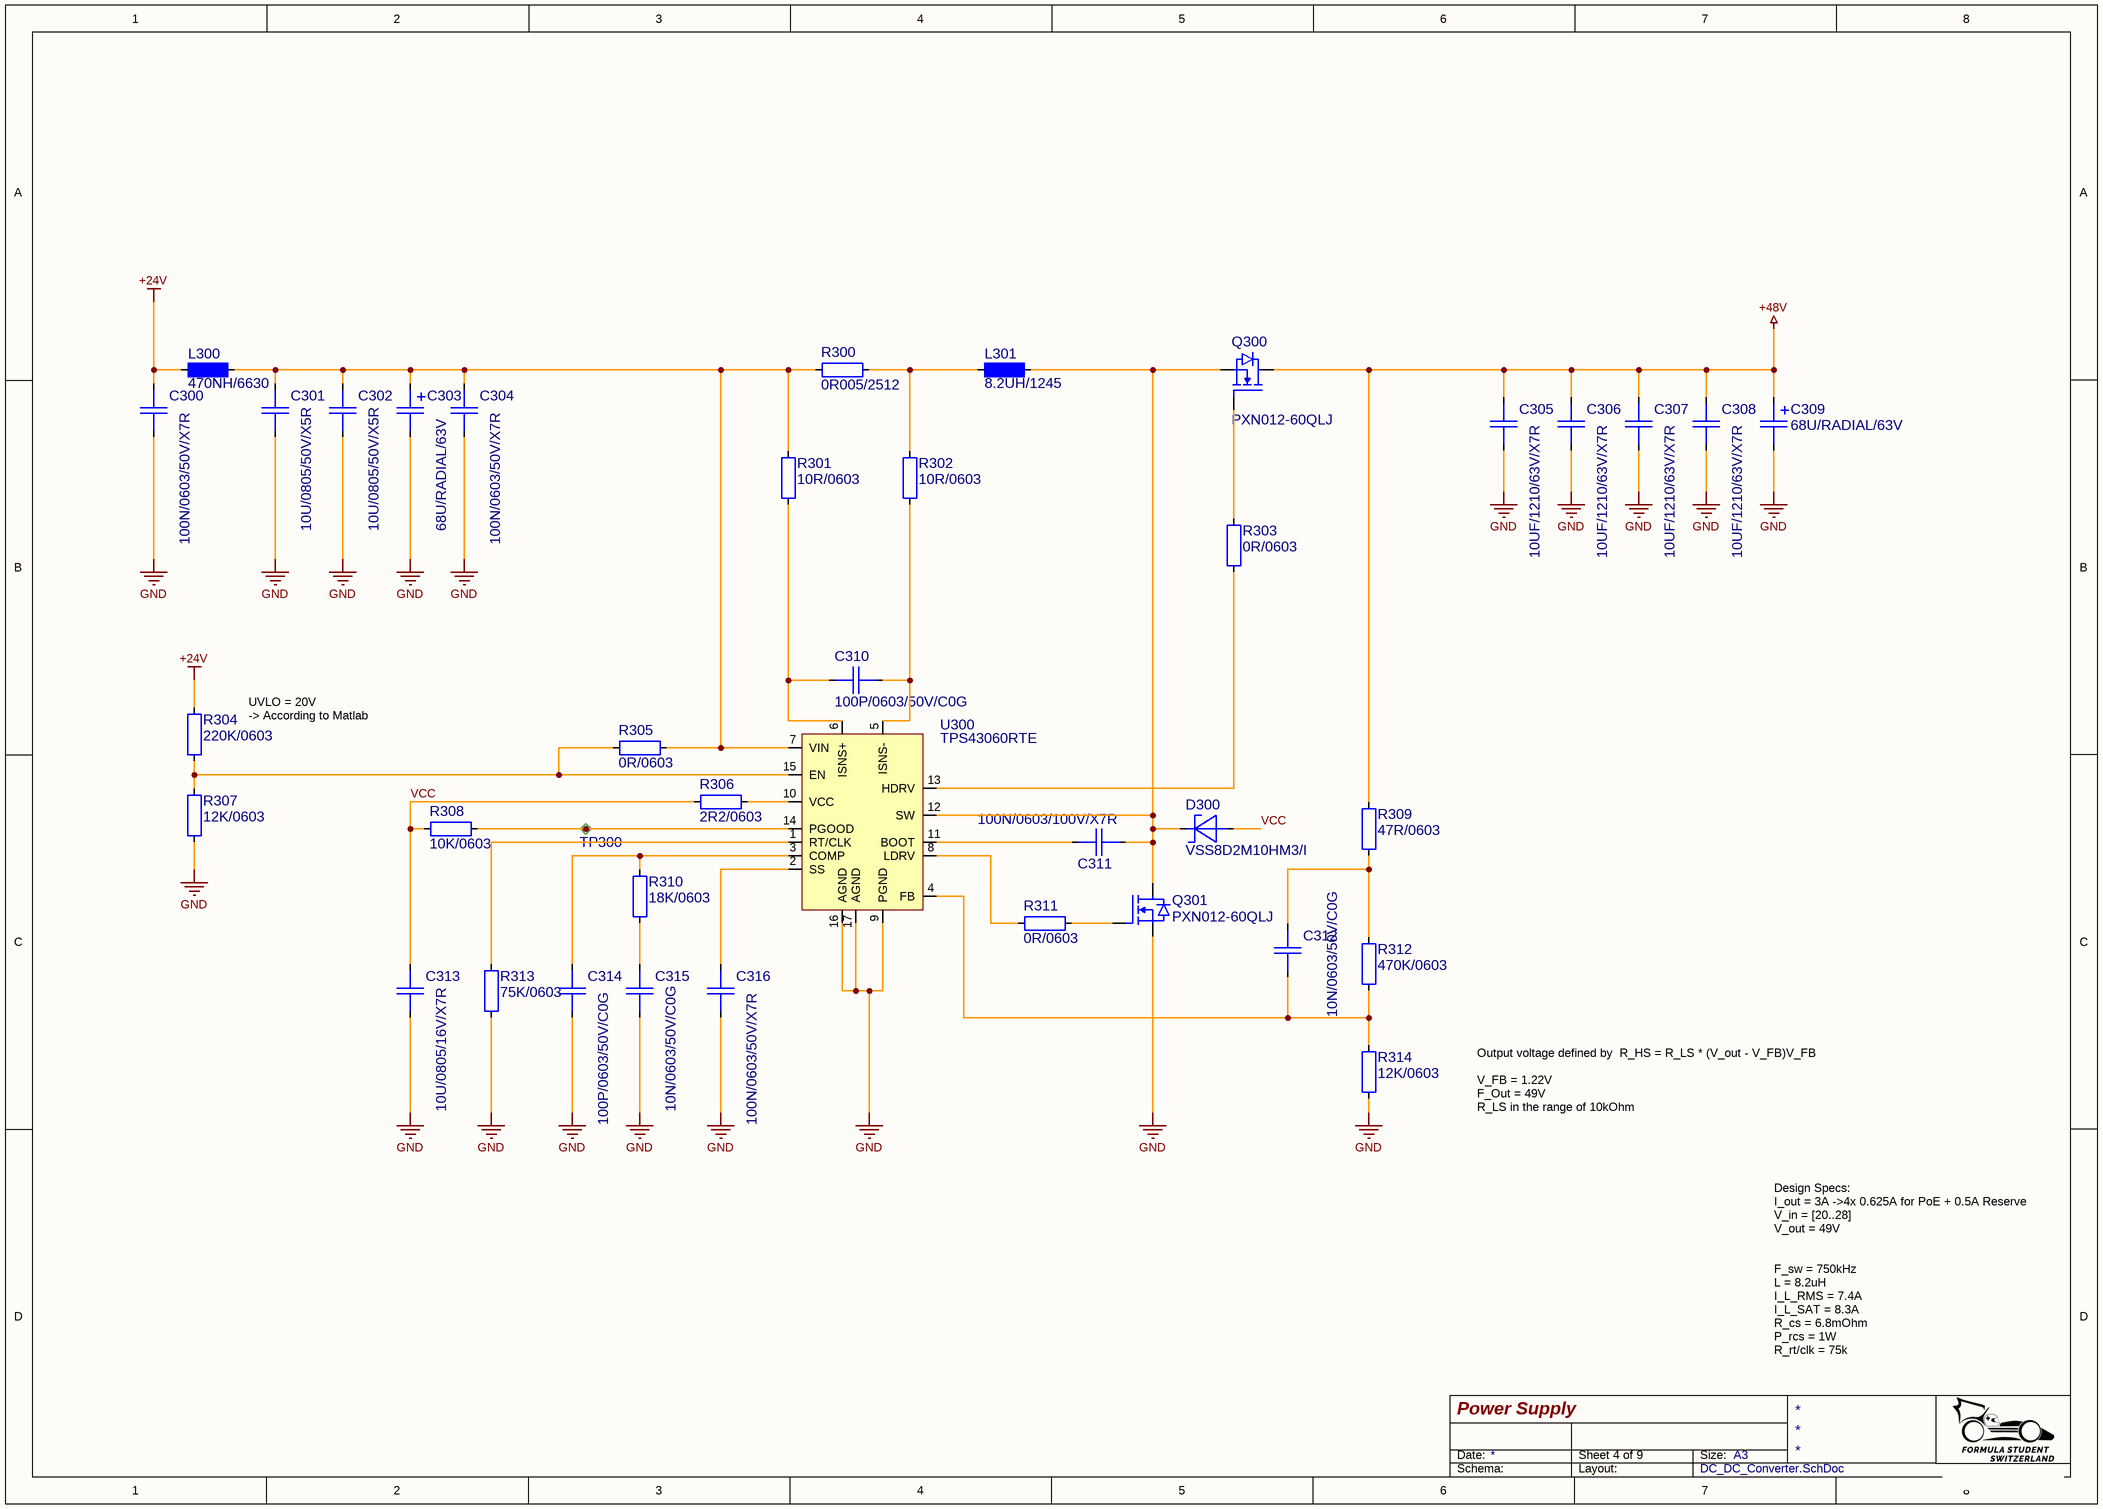
[diagram p3: DC_DC_Converter.SchDoc]

### Parts
C300  100N/0603/50V/X7R  [CAP0603_X7R]
C301  10U/0805/50V/X5R  [CAP0805_X7R]
C302  10U/0805/50V/X5R  [CAP0805_X7R]
C303  68U/RADIAL/63V  [CAP350P80X130]
C304  100N/0603/50V/X7R  [CAP0603_X7R]
C305  10UF/1210/63V/X7R  [CAP1210_X7R]
C306  10UF/1210/63V/X7R  [CAP1210_X7R]
C307  10UF/1210/63V/X7R  [CAP1210_X7R]
C308  10UF/1210/63V/X7R  [CAP1210_X7R]
C309  68U/RADIAL/63V  [CAP350P80X130]
C310  100P/0603/50V/C0G  [CAP0603_C0G]
C311  100N/0603/100V/X7R  [CAP0603_X7R]
C312  10N/0603/50V/C0G  [CAP0603_C0G]
C313  10U/0805/16V/X7R  [CAP0805_X7R]
C314  100P/0603/50V/C0G  [CAP0603_C0G]
C315  10N/0603/50V/C0G  [CAP0603_C0G]
C316  100N/0603/50V/X7R  [CAP0603_X7R]
D300  VSS8D2M10HM3/I  [SOD4026X100]
L300  470NH/6630  [INDM660730X30]
L301  8.2UH/1245  [INDM126126X47]
Q300  PXN012-60QLJ  [SON065P330X330X075-5-TH245X175]
Q301  PXN012-60QLJ  [SON065P330X330X075-5-TH245X175]
R300  0R005/2512  [R2512-0.65-WW]
R301  10R/0603  [R0603-0.40-WW]
R302  10R/0603  [R0603-0.40-WW]
R303  0R/0603  [R0603-0.40-WW]
R304  220K/0603  [R0603-0.40-WW]
R305  0R/0603  [R0603-0.40-WW]
R306  2R2/0603  [R0603-0.40-WW]
R307  12K/0603  [R0603-0.40-WW]
R308  10K/0603  [R0603-0.40-WW]
R309  47R/0603  [R0603-0.40-WW]
R310  18K/0603  [R0603-0.40-WW]
R311  0R/0603  [R0603-0.40-WW]
R312  470K/0603  [R0603-0.40-WW]
R313  75K/0603  [R0603-0.40-WW]
R314  12K/0603  [R0603-0.40-WW]
TP300  TP_SMD_1  [TP_SMD_1]  (value not drawn)  (no BOM)
U300  TPS43060RTE  [QFN050P300X300X080-16-TH120X80]

### Nets
+24V: C300.1 L300.1 R304.1
+48V: C305.1 C306.1 C307.1 C308.1 C309.1 Q300.D(DRAIN) R309.1
GND: C300.2 C301.2 C302.2 C303.2 C304.1 C305.2 C306.2 C307.2 C308.2 C309.2 C313.2 C314.2 C315.2 C316.2 Q301.S(SOURCE) R307.2 R313.2 R314.2 U300.9(PGND) U300.16(AGND) U300.17(AGND)
VCC: C313.1 D300.2 R306.1 R308.1
NetC301_1: C301.1 C302.1 C303.1 C304.2 L300.2 R300.1 R301.1 R305.2 U300.7(VIN)
NetC310_1: C310.1 R301.2 U300.6(ISNS+)
NetC310_2: C310.2 R302.2 U300.5(ISNS-)
NetC311_1: C311.1 U300.11(BOOT)
NetC311_2: C311.2 D300.1 L301.2 Q300.S(SOURCE) Q301.D(DRAIN) U300.12(SW)
NetC312_1: C312.1 R309.2 R312.1
NetC312_2: C312.2 R312.2 R314.1 U300.4(FB)
NetC314_1: C314.1 R310.1 U300.3(COMP)
NetC315_1: C315.1 R310.2
NetC316_1: C316.1 U300.2(SS)
NetL301_1: L301.1 R300.2 R302.1
NetQ300_G: Q300.G(GATE) R303.2
NetQ301_G: Q301.G(GATE) R311.2
NetR303_1: R303.1 U300.13(HDRV)
NetR304_2: R304.2 R305.1 R307.1 U300.15(EN)
NetR306_2: R306.2 U300.10(VCC)
NetR308_2: R308.2 TP300.1 U300.14(PGOOD)
NetR311_1: R311.1 U300.8(LDRV)
NetR313_1: R313.1 U300.1(RT/CLK)

### Notes on the sheet
- UVLO = 20V
  -> According to Matlab
- Output voltage defined by  R_HS = R_LS * (V_out - V_FB)V_FB
  V_FB = 1.22V
  F_Out = 49V
  R_LS in the range of 10kOhm
- Design Specs:
  I_out = 3A ->4x 0.625A for PoE + 0.5A Reserve
  V_in = [20..28]
  V_out = 49V
  F_sw = 750kHz
  L = 8.2uH
  I_L_RMS = 7.4A
  I_L_SAT = 8.3A
  R_cs = 6.8mOhm
  P_rcs = 1W
  R_rt/clk = 75k
- Date:
- Size:
- A3
- Schema:
- Layout:

### Library data of the parts
C300 C304 C316 = 100N/0603/50V/X7R: as C201 on sheet Charger; Part Number: 100N/0603/50V/X7R; Package: 0603; Value: 100nF; HelpURL: https://www.yageo.com/upload/media/product/app/datasheet/mlcc/upy-gphc_x7r_6_3v-to-250v.pdf; Supplier 1: Digi-Key; Supplier Part Number 1: 311-3567-1-ND; Manufacturer 2: YAGEO; Manufacturer Part Number 2: CC0603MRX7R9BB104; Supplier 2: Digi-Key; Supplier Part Number 2: 311-4110-1-ND; Supplier 3: LCSC; Supplier Part Number 3: C14663; JLC Type: Basic
C301 C302 = 10U/0805/50V/X5R: as C204 on sheet Charger; Part Number: 10U/0805/50V/X5R; Package: 0805; Value: 10uF; HelpURL: https://search.murata.co.jp/Ceramy/image/img/A01X/G101/ENG/GRM21BR61H106KE43-01A.pdf; Supplier 1: Digi-Key; Supplier Part Number 1: 490-GRM21BR61H106KE43KCT-ND; Manufacturer Part Number 3: GRM21BR61H106KE43L; Supplier 3: LCSC; Supplier Part Number 3: C440198; JLC Type: Basic
C303 C309 = 68U/RADIAL/63V: CAP THT 8C130 68UF ELKO 63V; Manufacturer: GENERIC; Manufacturer 1: Würth Elektronik; Manufacturer Part Number 1: 860020774014; Absolute Value: 6.8E-5; Part Number: 68U/RADIAL/63V; Package: RADIAL; Value: 68UF; HelpURL: https://www.we-online.com/components/products/datasheet/860020774014.pdf; Supplier 1: Digi-Key; Supplier Part Number 1: 732-8975-1-ND; Manufacturer Part Number 3: LKMD0901K680MF; Supplier 3: LCSC; Supplier Part Number 3: C443065
C305-C308 = 10UF/1210/63V/X7R: CAP SM 1210 10uF 63V X7R; Manufacturer: GENERIC; Manufacturer 1: Samsung Electro-Mechanics; Manufacturer Part Number 1: CL32B106KMVNNWE; Absolute Value: 1E-5; Part Number: 10UF/1210/63V/X7R; Package: 1210; Value: 10UF; HelpURL: https://mm.digikey.com/Volume0/opasdata/d220001/medias/docus/2124/CL32B106KMVNNWE_Spec.pdf; Supplier 1: Digi-Key; Supplier Part Number 1: 1276-7053-1-ND; Manufacturer Part Number 3: CGA1210X7R106K630RT; Supplier 3: LCSC; Supplier Part Number 3: C6120029
C310 C314 = 100P/0603/50V/C0G: CAP SM 0603 100pF 50V C0G; Manufacturer: GENERIC; Manufacturer 1: YAGEO; Manufacturer Part Number 1: CC0603JRNPO9BN101; Absolute Value: 1E-10; Eurocircuits GPN: GPC0603101-C0G; Part Number: 100P/0603/50V/C0G; Package: 0603; Value: 100pF; HelpURL: https://www.yageo.com/upload/media/product/productsearch/datasheet/mlcc/UPY-GP_NP0_16V-to-50V_18.pdf; Supplier 1: Digi-Key; Supplier Part Number 1: 311-1069-1-ND; Manufacturer 2: YAGEO; Manufacturer Part Number 2: CC0603KRNPO9BN101; Supplier 2: Digi-Key; Supplier Part Number 2: 311-3600-1-ND
C311 = 100N/0603/100V/X7R: CAP SM 0603 100nF 100V X7R; Manufacturer: GENERIC; Manufacturer 1: Samsung Electro-Mechanics; Manufacturer Part Number 1: CL10B104KC8NNNC; Absolute Value: 2.2E-8; Eurocircuits GPN: GPC0603104-100; Part Number: 100N/0603/100V/X7R; Package: 0603; Value: 100nF; HelpURL: https://mm.digikey.com/Volume0/opasdata/d220001/medias/docus/1296/CL10B104KC8NNNC_Spec.pdf; Supplier 1: Digi-Key; Supplier Part Number 1: 1276-6807-1-ND; Manufacturer Part Number 3: CGA0603X7R104K101JT; Supplier 3: LCSC; Supplier Part Number 3: C6119850
C312 C315 = 10N/0603/50V/C0G: CAP SM 0603 10nF 50V C0G; Manufacturer: GENERIC; Manufacturer 1: YAGEO; Manufacturer Part Number 1: CC0603JRNPO9BN103; Absolute Value: 1E-8; Eurocircuits GPN: GPC0603103-C0G; Part Number: 10N/0603/50V/C0G; Package: 0603; Value: 10nF; HelpURL: https://www.yageo.com/upload/media/product/productsearch/datasheet/mlcc/UPY-GP_NP0_16V-to-50V_18.pdf; Supplier 1: Digi-Key; Supplier Part Number 1: 311-3960-1-ND
C313 = 10U/0805/16V/X7R: as C200 on sheet Charger; Part Number: 10U/0805/16V/X7R; Package: 0805; Value: 10uF; HelpURL: https://88ce57.p3cdn1.secureserver.net/wp-content/uploads/2023/01/gmc_series-2.pdf; Supplier 1: Digi-Key; Supplier Part Number 1: 4713-GMC21X7R106K16NTCT-ND; Manufacturer 2: Samsung Electro-Mechanics; Manufacturer Part Number 2: CL21B106KOQNNNE; Supplier 2: Digi-Key; Supplier Part Number 2: 1276-2872-1-ND; Supplier 3: LCSC; Supplier Part Number 3: C95841; JLC Type: Basic
D300 = VSS8D2M10HM3/I: 100V 560mV@2A 2A DO-221AD Automotive Schottky Barrier Diode; Manufacturer: GENERIC; Manufacturer 1: Vishay General Semiconductor - Diodes Division; Part Number: VSS8D2M10HM3/I; Package: DO-221AD, SOD-128; Value: VSS8D2M10HM3/I; Absolute Value: 100V; HelpURL: https://www.vishay.com/docs/87442/vss8d2m10.pdf; Manufacturer Part Number 1: VSS8D2M10HM3/I; Supplier 1: Digi-Key; Supplier Part Number 1: 112-VSS8D2M10HM3/ICT-ND
L300 = 470NH/6630: as L200 on sheet Charger; Part Number: 470NH/6630; Package: 6030 Inductor; Value: 470NH; HelpURL: https://productfinder.pulseelectronics.com/api/open/part-attachments/datasheet/BMRA00060630R47MA1; Supplier 1: Digi-Key; Supplier Part Number 1: 553-BMRA00060630R47MA1CT-ND
L301 = 8.2UH/1245: FIXED IND 8.2UH 1.5 A 21.5 MOHM SMD; Manufacturer: GENERIC; Manufacturer 1: Bourns Inc.; Manufacturer Part Number 1: SRP1245C-8R2M; Absolute Value: 8.2E-6; Part Number: 8.2UH/1245; Package: 1245 Inductor; HelpURL: https://www.bourns.com/docs/product-datasheets/srp1245c.pdf; Supplier 1: Digi-Key; Supplier Part Number 1: 118-SRP1245C-8R2MCT-ND
Q300 Q301 = PXN012-60QLJ: N-channel 60 V, 11.5 mOhm, logic level Trench MOSFET in MLPAK33; Manufacturer: Nexperia USA Inc.; Part Number: PXN012-60QLJ; HelpURL: https://assets.nexperia.com/documents/data-sheet/PXN012-60QL.pdf; Manufacturer 1: Nexperia USA Inc.; Manufacturer Part Number 1: PXN012-60QLJ; Supplier 1: Digi-Key; Supplier Part Number 1: 1727-PXN012-60QLJCT-ND
R300 = 0R005/2512: RES SM 2512 0R005; Manufacturer: GENERIC; Manufacturer 1: Ohmite; Manufacturer Part Number 1: MCS3264R005FER; Absolute Value: 0.005; Part Number: 0R005/2512; Package: 2512; Value: 0R005; HelpURL: https://www.ohmite.com/assets/docs/res_mcs.pdf?r=false; Supplier 1: Digi-Key; Supplier Part Number 1: MCS3264R005FERCT-ND
R301 R302 = 10R/0603: as R209 on sheet Charger; Part Number: 10R/0603; Package: 0603; Value: 10R; HelpURL: https://www.yageo.com/upload/media/product/app/datasheet/rchip/pyu-rc_group_51_rohs_l.pdf; Supplier 1: Digi-Key; Supplier Part Number 1: 13-RC0603FR-1310RLCT-ND; Manufacturer 2: YAGEO; Manufacturer Part Number 2: RC0603FR-1010RL; Supplier 2: Digi-Key; Supplier Part Number 2: 13-RC0603FR-1010RLCT-ND
R303 R305 R311 = 0R/0603: RES SM 0603 0R; Manufacturer: GENERIC; Manufacturer 1: YAGEO; Manufacturer Part Number 1: RC0603FR-070RL; Absolute Value: 0; Eurocircuits GPN: GPR06030R; Part Number: 0R/0603; Package: 0603; Value: 0R; HelpURL: https://www.yageo.com/upload/media/product/app/datasheet/rchip/pyu-rc_group_51_rohs_l.pdf; Supplier 1: Digi-Key; Supplier Part Number 1: 311-0.0HRCT-ND; Manufacturer 2: YAGEO; Manufacturer Part Number 2: RC0603FR-130RL; Supplier 2: Digi-Key; Supplier Part Number 2: 13-RC0603FR-130RLCT-ND; Manufacturer 3: UNI-ROYAL(Uniroyal Elec); Manufacturer Part Number 3: 0603WAF0000T5E; Supplier 3: LCSC; Supplier Part Number 3: C21189; JLC Type: Basic
R304 = 220K/0603: RES SM 0603 220K; Manufacturer: GENERIC; Manufacturer 1: YAGEO; Manufacturer Part Number 1: RC0603FR-13220KL; Absolute Value: 220000; Eurocircuits GPN: GPR0603220K; Part Number: 220K/0603; Package: 0603; Value: 220K; HelpURL: https://www.yageo.com/upload/media/product/productsearch/datasheet/rchip/PYu-RC_Group_51_RoHS_L_12.pdf; Supplier 1: Digi-Key; Supplier Part Number 1: 13-RC0603FR-13220KLCT-ND; Manufacturer 2: YAGEO; Manufacturer Part Number 2: RC0603FR-10220KL; Supplier 2: Digi-Key; Supplier Part Number 2: 13-RC0603FR-10220KLCT-ND; Manufacturer 3: UNI-ROYAL(Uniroyal Elec); Manufacturer Part Number 3: 0603WAF2203T5E; Supplier 3: LCSC; Supplier Part Number 3: C22961; JLC Type: Basic
R306 = 2R2/0603: RES SM 0603 2R2; Manufacturer: GENERIC; Manufacturer 1: YAGEO; Manufacturer Part Number 1: RC0603FR-132R2L; Absolute Value: 2.2; Eurocircuits GPN: GPR06032R2; Part Number: 2R2/0603; Package: 0603; Value: 2R2; HelpURL: https://www.yageo.com/upload/media/product/productsearch/datasheet/rchip/PYu-RC_Group_51_RoHS_L_12.pdf; Supplier 1: Digi-Key; Supplier Part Number 1: 13-RC0603FR-132R2LCT-ND; Manufacturer 2: YAGEO; Manufacturer Part Number 2: RC0603FR-072R2L; Supplier 2: Digi-Key; Supplier Part Number 2: 311-2.2HRCT-ND
R307 R314 = 12K/0603: RES SM 0603 12K; Manufacturer: GENERIC; Manufacturer 1: YAGEO; Manufacturer Part Number 1: RC0603FR-1312KL; Absolute Value: 12000; Eurocircuits GPN: GPR060312K; Part Number: 12K/0603; Package: 0603; Value: 12K; HelpURL: https://www.yageo.com/upload/media/product/app/datasheet/rchip/pyu-rc_group_51_rohs_l.pdf; Supplier 1: Digi-Key; Supplier Part Number 1: 13-RC0603FR-1312KLCT-ND; Manufacturer 2: YAGEO; Manufacturer Part Number 2: RC0603FR-1012KL; Supplier 2: Digi-Key; Supplier Part Number 2: 13-RC0603FR-1012KLCT-ND
R308 = 10K/0603: as R220 on sheet Charger; Part Number: 10K/0603; Package: 0603; Value: 10K; HelpURL: https://www.yageo.com/upload/media/product/productsearch/datasheet/rchip/PYu-RC_Group_51_RoHS_L_12.pdf; Supplier 1: Digi-Key; Supplier Part Number 1: 13-RC0603FR-1310KLCT-ND; Manufacturer 2: YAGEO; Manufacturer Part Number 2: RC0603FR-1010KL; Supplier 2: Digi-Key; Supplier Part Number 2: 13-RC0603FR-1010KLCT-ND; Manufacturer 3: UNI-ROYAL(Uniroyal Elec); Manufacturer Part Number 3: 0603WAF1002T5E; Supplier 3: LCSC; Supplier Part Number 3: C25804; JLC Type: Basic
R309 = 47R/0603: RES SM 0603 47R; Manufacturer: GENERIC; Manufacturer 1: YAGEO; Manufacturer Part Number 1: RC0603FR-1347RL; Absolute Value: 47; Eurocircuits GPN: GPR060347R; Part Number: 47R/0603; Package: 0603; Value: 47R; HelpURL: https://www.yageo.com/upload/media/product/app/datasheet/rchip/pyu-rc_group_51_rohs_l.pdf; Supplier 1: Digi-Key; Supplier Part Number 1: 13-RC0603FR-1347RLCT-ND; Manufacturer 2: YAGEO; Manufacturer Part Number 2: RC0603FR-1047RL; Supplier 2: Digi-Key; Supplier Part Number 2: 13-RC0603FR-1047RLCT-ND
R310 = 18K/0603: RES SM 0603 18K; Manufacturer: GENERIC; Manufacturer 1: YAGEO; Manufacturer Part Number 1: RC0603FR-1318KL; Absolute Value: 18000; Eurocircuits GPN: GPR060318K; Part Number: 18K/0603; Package: 0603; Value: 18K; HelpURL: https://www.yageo.com/upload/media/product/productsearch/datasheet/rchip/PYu-RC_Group_51_RoHS_L_12.pdf; Supplier 1: Digi-Key; Supplier Part Number 1: 13-RC0603FR-1318KLCT-ND; Manufacturer 2: YAGEO; Manufacturer Part Number 2: RC0603FR-1018KL; Supplier 2: Digi-Key; Supplier Part Number 2: 13-RC0603FR-1018KLCT-ND
R312 = 470K/0603: RES SM 0603 470K; Manufacturer: GENERIC; Manufacturer 1: YAGEO; Manufacturer Part Number 1: RC0603FR-13470KL; Absolute Value: 470000; Eurocircuits GPN: GPR0603470K; Part Number: 470K/0603; Package: 0603; Value: 470K; HelpURL: https://www.yageo.com/upload/media/product/app/datasheet/rchip/pyu-rc_group_51_rohs_l.pdf; Supplier 1: Digi-Key; Supplier Part Number 1: 13-RC0603FR-13470KLCT-ND; Manufacturer 2: YAGEO; Manufacturer Part Number 2: RC0603FR-10470KL; Supplier 2: Digi-Key; Supplier Part Number 2: 13-RC0603FR-10470KLCT-ND
R313 = 75K/0603: RES SM 0603 75K; Manufacturer: GENERIC; Manufacturer 1: YAGEO; Manufacturer Part Number 1: RC0603FR-1375KL; Absolute Value: 75000; Eurocircuits GPN: GPR060375K; Part Number: 75K/0603; Package: 0603; Value: 75K; HelpURL: https://www.yageo.com/upload/media/product/app/datasheet/rchip/pyu-rc_group_51_rohs_l.pdf; Supplier 1: Digi-Key; Supplier Part Number 1: 13-RC0603FR-1375KLCT-ND; Manufacturer 2: YAGEO; Manufacturer Part Number 2: RC0603FR-1075KL; Supplier 2: Digi-Key; Supplier Part Number 2: 13-RC0603FR-1075KLCT-ND; Manufacturer 3: YAGEO; Manufacturer Part Number 3: RC0603FR-0775KL; Supplier 3: LCSC; Supplier Part Number 3: C114636; JLC Type: Basic
TP300 = TP_IL_SMD_1: SMD Test Point 1mm; Manufacturer: NONE; Part Number: TP_IL_SMD_1
U300 = TPS43060RTE: TPS4306x Low Quiescent Current Synchronous Boost DC-DC Controller With Wide VIN Range; Manufacturer: Texas Instruments; Manufacturer Part Number 1: TPS43060RTER; Part Number: TPS43060RTE; Package: PWQFN-16; HelpURL: https://www.ti.com/lit/ds/symlink/tps43060.pdf; Manufacturer 1: Texas Instruments; Supplier 1: Digi-Key; Supplier Part Number 1: 296-39400-1-ND; Manufacturer 3: Texas Instruments; Manufacturer Part Number 3: TPS43060RTER; Supplier 3: LCSC; Supplier Part Number 3: C76516

## Sheet PoE_Injector.SchDoc: IEEE802.3AF/AT PSE Controller
size A3; SheetNumber: 5; SheetTotal: 9
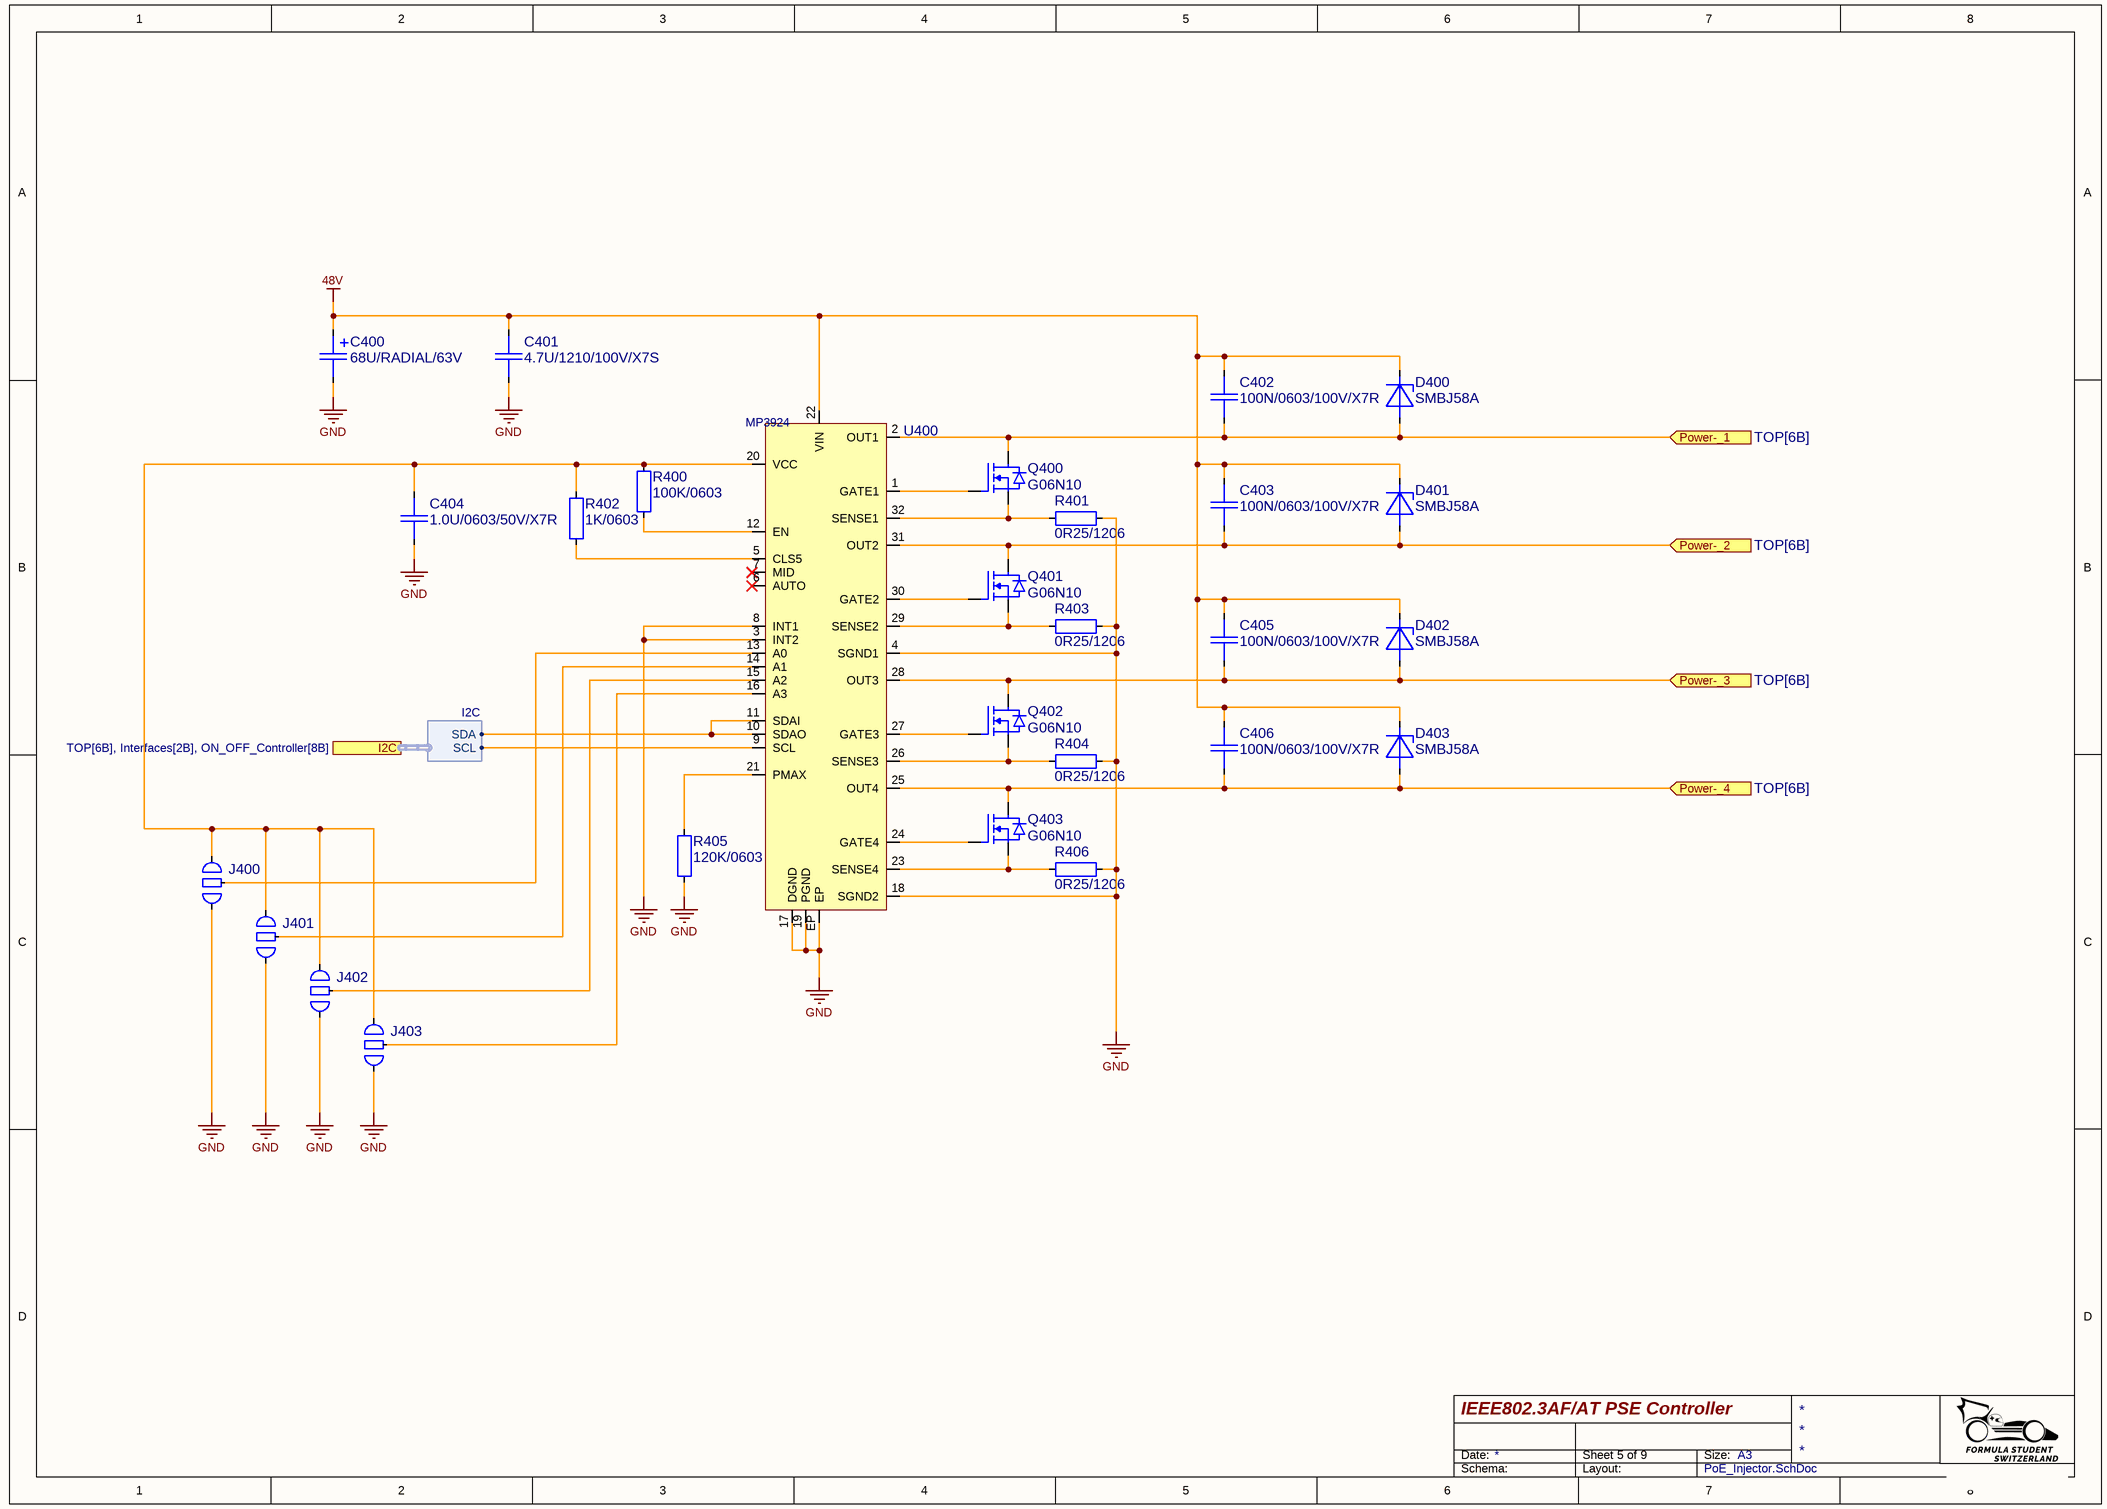
[diagram p4: PoE_Injector.SchDoc]

### Parts
C400  68U/RADIAL/63V  [CAP350P80X130]
C401  4.7U/1210/100V/X7S  [CAP1210_X7R]
C402  100N/0603/100V/X7R  [CAP0603_X7R]
C403  100N/0603/100V/X7R  [CAP0603_X7R]
C404  1.0U/0603/50V/X7R  [CAP0603_X7R]
C405  100N/0603/100V/X7R  [CAP0603_X7R]
C406  100N/0603/100V/X7R  [CAP0603_X7R]
D400  SMBJ58A  [DIOM5436X265]
D401  SMBJ58A  [DIOM5436X265]
D402  SMBJ58A  [DIOM5436X265]
D403  SMBJ58A  [DIOM5436X265]
J400  Solder Jumper 3pin 0.2mm  [Solder_Jumper_3pin_0.2mm]  (value not drawn)
J401  Solder Jumper 3pin 0.2mm  [Solder_Jumper_3pin_0.2mm]  (value not drawn)
J402  Solder Jumper 3pin 0.2mm  [Solder_Jumper_3pin_0.2mm]  (value not drawn)
J403  Solder Jumper 3pin 0.2mm  [Solder_Jumper_3pin_0.2mm]  (value not drawn)
Q400  G06N10  [TO228P990X229-3]
Q401  G06N10  [TO228P990X229-3]
Q402  G06N10  [TO228P990X229-3]
Q403  G06N10  [TO228P990X229-3]
R400  100K/0603  [R0603-0.40-WW]
R401  0R25/1206  [R1206-0.80-WW]
R402  1K/0603  [R0603-0.40-WW]
R403  0R25/1206  [R1206-0.80-WW]
R404  0R25/1206  [R1206-0.80-WW]
R405  120K/0603  [R0603-0.40-WW]
R406  0R25/1206  [R1206-0.80-WW]
U400  MP3924  [QFN050P500X500X100-32-TH360X360]

### Ports
I2C (harness I2C, see TOP[6B], Interfaces[2B], ON_OFF_Controller[8B]), Power-_1 (in, see TOP[6B]), Power-_2 (in, see TOP[6B]), Power-_3 (in, see TOP[6B]), Power-_4 (in, see TOP[6B])

### Harnesses
I2C: SCL, SDA

### Nets
48V: C400.1 C401.1 C402.1 C403.1 C405.1 C406.1 D400.1 D401.1 D402.1 D403.1 U400.22(VIN)
GND: C400.2 C401.2 C404.2 J400.1 J401.1 J402.1 J403.1 R401.2 R403.2 R404.2 R405.2 R406.2 U400.3(INT2) U400.4(SGND1) U400.8(INT1) U400.17(DGND) U400.18(SGND2) U400.19(PGND) U400.EP
I2C.SCL: U400.9(SCL) ; port I2C.SCL
I2C.SDA: U400.10(SDAO) U400.11(SDAI) ; port I2C.SDA
NetC402_2: C402.2 D400.2 Q400.3(DRAIN) U400.2(OUT1) ; port Power-_1
NetC403_2: C403.2 D401.2 Q401.3(DRAIN) U400.31(OUT2) ; port Power-_2
NetC404_1: C404.1 J400.3 J401.3 J402.3 J403.3 R400.1 R402.1 U400.20(VCC)
NetC405_2: C405.2 D402.2 Q402.3(DRAIN) U400.28(OUT3) ; port Power-_3
NetC406_2: C406.2 D403.2 Q403.3(DRAIN) U400.25(OUT4) ; port Power-_4
NetJ400_2: J400.2 U400.13(A0)
NetJ401_2: J401.2 U400.14(A1)
NetJ402_2: J402.2 U400.15(A2)
NetJ403_2: J403.2 U400.16(A3)
NetQ400_1: Q400.1(GATE) U400.1(GATE1)
NetQ400_2: Q400.2(SOURCE) R401.1 U400.32(SENSE1)
NetQ401_1: Q401.1(GATE) U400.30(GATE2)
NetQ401_2: Q401.2(SOURCE) R403.1 U400.29(SENSE2)
NetQ402_1: Q402.1(GATE) U400.27(GATE3)
NetQ402_2: Q402.2(SOURCE) R404.1 U400.26(SENSE3)
NetQ403_1: Q403.1(GATE) U400.24(GATE4)
NetQ403_2: Q403.2(SOURCE) R406.1 U400.23(SENSE4)
NetR400_2: R400.2 U400.12(EN)
NetR402_2: R402.2 U400.5(CLS5)
NetR405_1: R405.1 U400.21(PMAX)

Not connected (* = marked no-connect by the designer): U400 6(AUTO)* 7(MID)*

### Notes on the sheet
- Date:
- Size:
- A3
- Schema:
- Layout:

### Library data of the parts
C400 = 68U/RADIAL/63V: as C303 on sheet DC_DC_Converter; Part Number: 68U/RADIAL/63V; Package: RADIAL; Value: 68UF; HelpURL: https://www.we-online.com/components/products/datasheet/860020774014.pdf; Supplier 1: Digi-Key; Supplier Part Number 1: 732-8975-1-ND; Manufacturer Part Number 3: LKMD0901K680MF; Supplier 3: LCSC; Supplier Part Number 3: C443065
C401 = 4.7U/1210/100V/X7S: CAP SM 1210 4.7uF 100V X7S; Manufacturer: GENERIC; Manufacturer 1: Murata; Manufacturer Part Number 1: GRM31CC72A475ME11L; Absolute Value: 4.7E-6; Eurocircuits GPN: GPN1210475-100; Part Number: 4.7U/1210/100V/X7S; Package: 1210; Value: 4.7uF; HelpURL: https://search.murata.co.jp/Ceramy/image/img/A01X/G101/ENG/GRM31CC72A475ME11-01A.pdf; Supplier 1: Digi-Key; Supplier Part Number 1: 490-18621-1-ND; Manufacturer Part Number 3: CGA1210X7S475K101RT; Supplier 3: LCSC; Supplier Part Number 3: C6120041
C402 C403 C405 C406 = 100N/0603/100V/X7R: as C311 on sheet DC_DC_Converter; Part Number: 100N/0603/100V/X7R; Package: 0603; Value: 100nF; HelpURL: https://mm.digikey.com/Volume0/opasdata/d220001/medias/docus/1296/CL10B104KC8NNNC_Spec.pdf; Supplier 1: Digi-Key; Supplier Part Number 1: 1276-6807-1-ND; Manufacturer Part Number 3: CGA0603X7R104K101JT; Supplier 3: LCSC; Supplier Part Number 3: C6119850
C404 = 1.0U/0603/50V/X7R: as C210 on sheet Charger; Part Number: 1.0U/0603/50V/X7R; Package: 0603; Value: 1.0uF; HelpURL: https://www.yageo.com/upload/media/product/app/datasheet/mlcc/upy-gphc_x7r_6_3v-to-250v.pdf; Supplier 1: Digi-Key; Supplier Part Number 1: 311-2082-1-ND
D400-D403 = SMBJ58A: TVS DIODE 58VWM 93.6VC DO214AA; Manufacturer: Littelfuse Inc.; Absolute Value: 58V; Part Number: SMBJ58A; Package: DO-214AA, SMB; Value: SMBJ58A; HelpURL: https://www.littelfuse.com/media?resourcetype=datasheets&itemid=09a6ae9a-73cb-4ac4-acac-e6dab92ab953&filename=littelfuse_tvs_diode_smbj_datasheet.pdf; Manufacturer 1: Littelfuse Inc.; Manufacturer Part Number 1: SMBJ58A; Supplier 1: Digi-Key; Supplier Part Number 1: SMBJ58ALFCT-ND
J400-J403 = Solder_Jumper_3pin_0.2mm: Solder jumper with three pins with a spacing of 0.2mm; Manufacturer: NONE; Part Number: Solder_Jumper_3pin_0.2mm
Q400-Q403 = G06N10: N100V,RD(MAX)<240M@10V,VTH1.2V~3; Manufacturer: Goford; Manufacturer 1: Goford Semiconductors; Part Number: G06N10; Package: TO-252; Manufacturer Part Number 1: G06N10; Supplier 1: Digi-Key; Supplier Part Number 1: 3141-G06N10CT-ND; Manufacturer 3: HL; Manufacturer Part Number 3: S12N10; Supplier 3: LCSC; Supplier Part Number 3: C19100370
R400 = 100K/0603: as R201 on sheet Charger; Part Number: 100K/0603; Package: 0603; Value: 100K; HelpURL: https://www.yageo.com/upload/media/product/productsearch/datasheet/rchip/PYu-RC_Group_51_RoHS_L_12.pdf; Supplier 1: Digi-Key; Supplier Part Number 1: 13-RC0603FR-13100KLCT-ND; Manufacturer 2: YAGEO; Manufacturer Part Number 2: RC0603FR-10100KL; Supplier 2: Digi-Key; Supplier Part Number 2: 13-RC0603FR-10100KLCT-ND; Manufacturer 3: UNI-ROYAL(Uniroyal Elec); Manufacturer Part Number 3: 0603WAF1003T5E; Supplier 3: LCSC; Supplier Part Number 3: C25803; JLC Type: Basic
R401 R403 R404 R406 = 0R25/1206: as R208 on sheet Charger; Part Number: 0R25/1206; Package: 1206; Value: 0R25; HelpURL: https://www.yageo.com/upload/media/product/app/datasheet/rchip/pyu-rl_group_521_rohs_l.pdf; Supplier 1: Digi-Key; Supplier Part Number 1: 311-.25LWCT-ND; Manufacturer 3: RALEC; Manufacturer Part Number 3: RLT06R25JTP; Supplier 3: LCSC; Supplier Part Number 3: C7500327
R402 = 1K/0603: as R203 on sheet Charger; Part Number: 1K/0603; Package: 0603; Value: 1K; HelpURL: https://www.yageo.com/upload/media/product/app/datasheet/rchip/pyu-rc_group_51_rohs_l.pdf; Supplier 1: Digi-Key; Supplier Part Number 1: 13-RC0603FR-131KLCT-ND; Manufacturer 2: YAGEO; Manufacturer Part Number 2: RC0603FR-101KL; Supplier 2: Digi-Key; Supplier Part Number 2: 13-RC0603FR-101KLCT-ND; Manufacturer 3: UNI-ROYAL(Uniroyal Elec); Manufacturer Part Number 3: 0603WAF1001T5E; Supplier 3: LCSC; Supplier Part Number 3: C21190; JLC Type: Basic
R405 = 120K/0603: RES SM 0603 120K; Manufacturer: GENERIC; Manufacturer 1: YAGEO; Manufacturer Part Number 1: RC0603FR-13120KL; Absolute Value: 120000; Eurocircuits GPN: GPR0603120K; Part Number: 120K/0603; Package: 0603; Value: 120K; HelpURL: https://www.yageo.com/upload/media/product/app/datasheet/rchip/pyu-rc_group_51_rohs_l.pdf; Supplier 1: Digi-Key; Supplier Part Number 1: 13-RC0603FR-13120KLCT-ND; Manufacturer 2: YAGEO; Manufacturer Part Number 2: RC0603FR-10120KL; Supplier 2: Digi-Key; Supplier Part Number 2: 13-RC0603FR-10120KLCT-ND
U400 = MP3924: Quad-Port, IEEE 802.3af/at PSE Controller for Power over Ethernet; Manufacturer: MPS; Manufacturer 1: Monolithic Power Systems Inc.; Manufacturer Part Number 1: MP3924GU-Z; Part Number: MP3924; Package: QFN-32; HelpURL: https://www.monolithicpower.com/en/documentview/productdocument/index/version/2/document_type/Datasheet/lang/en/sku/MP3924GU/document_id/9919/; Supplier 1: Digi-Key; Supplier Part Number 1: 1589-MP3924GU-ZCT-ND